# EAGLE design controller (EAGLE 6.5.0)
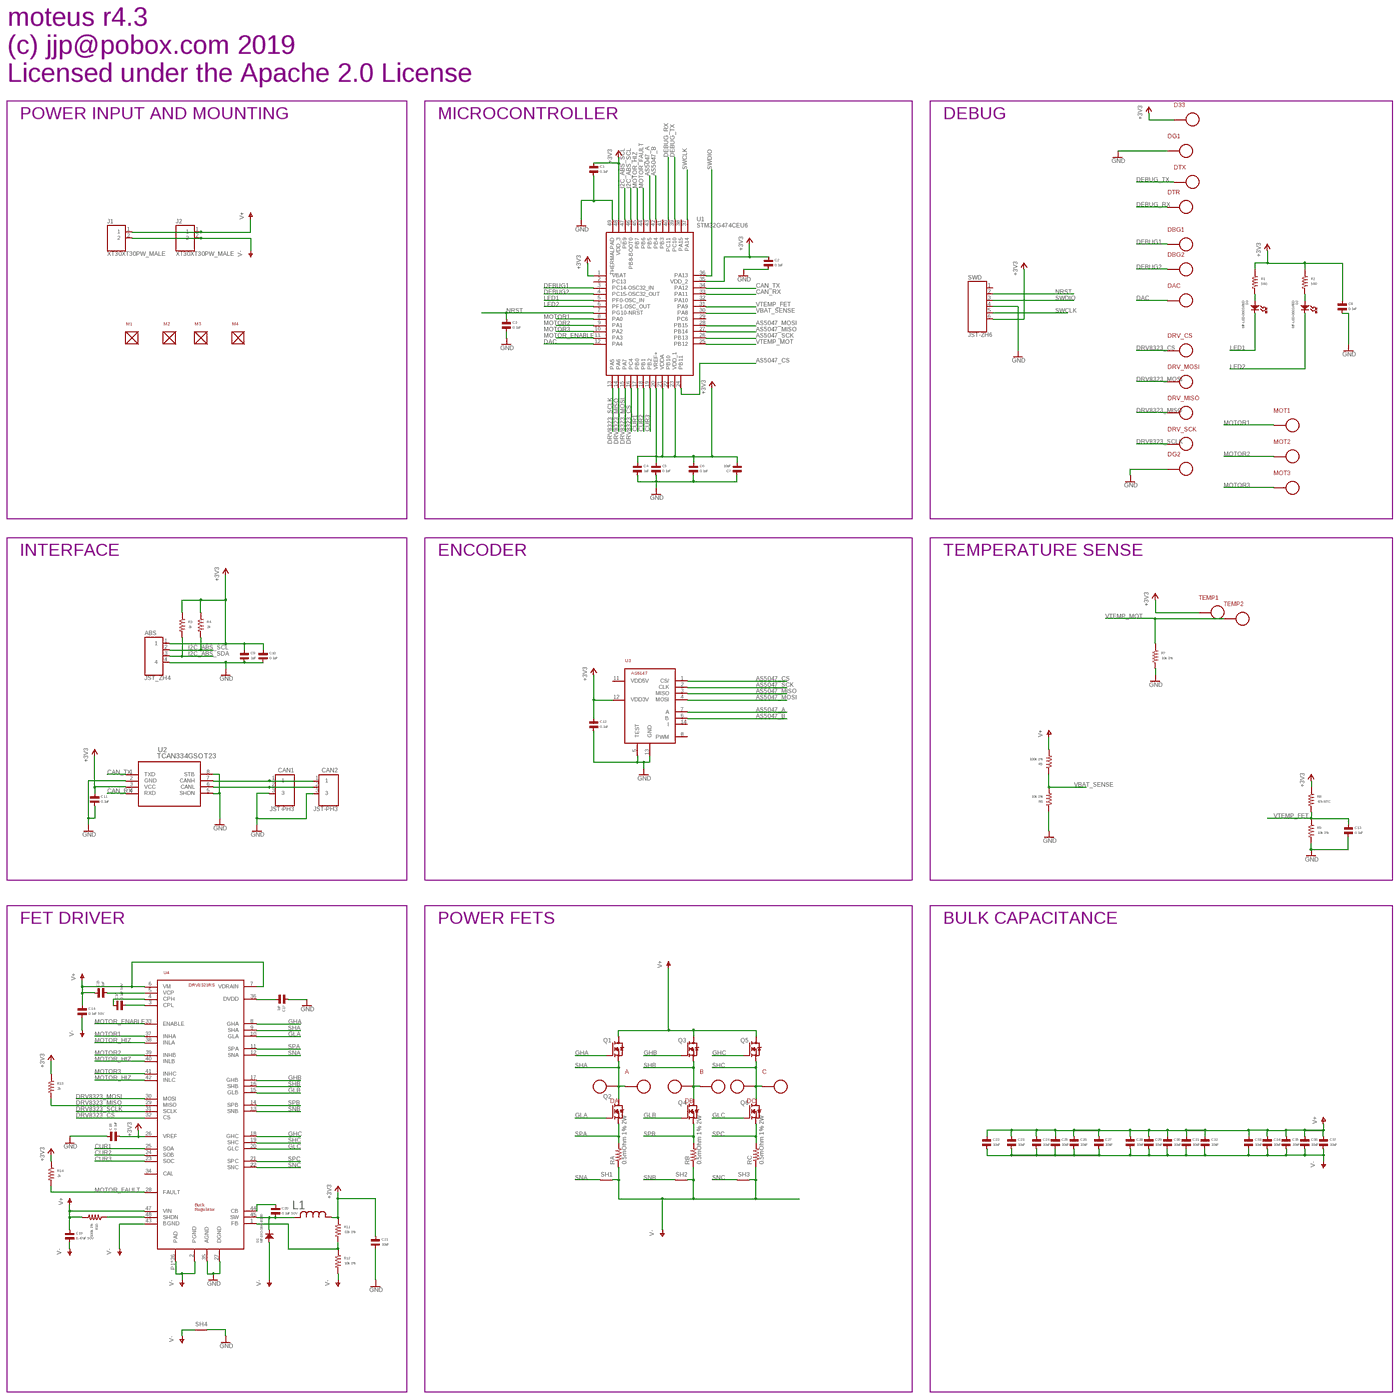
[diagram p0: schematic, sheet 1, overview]
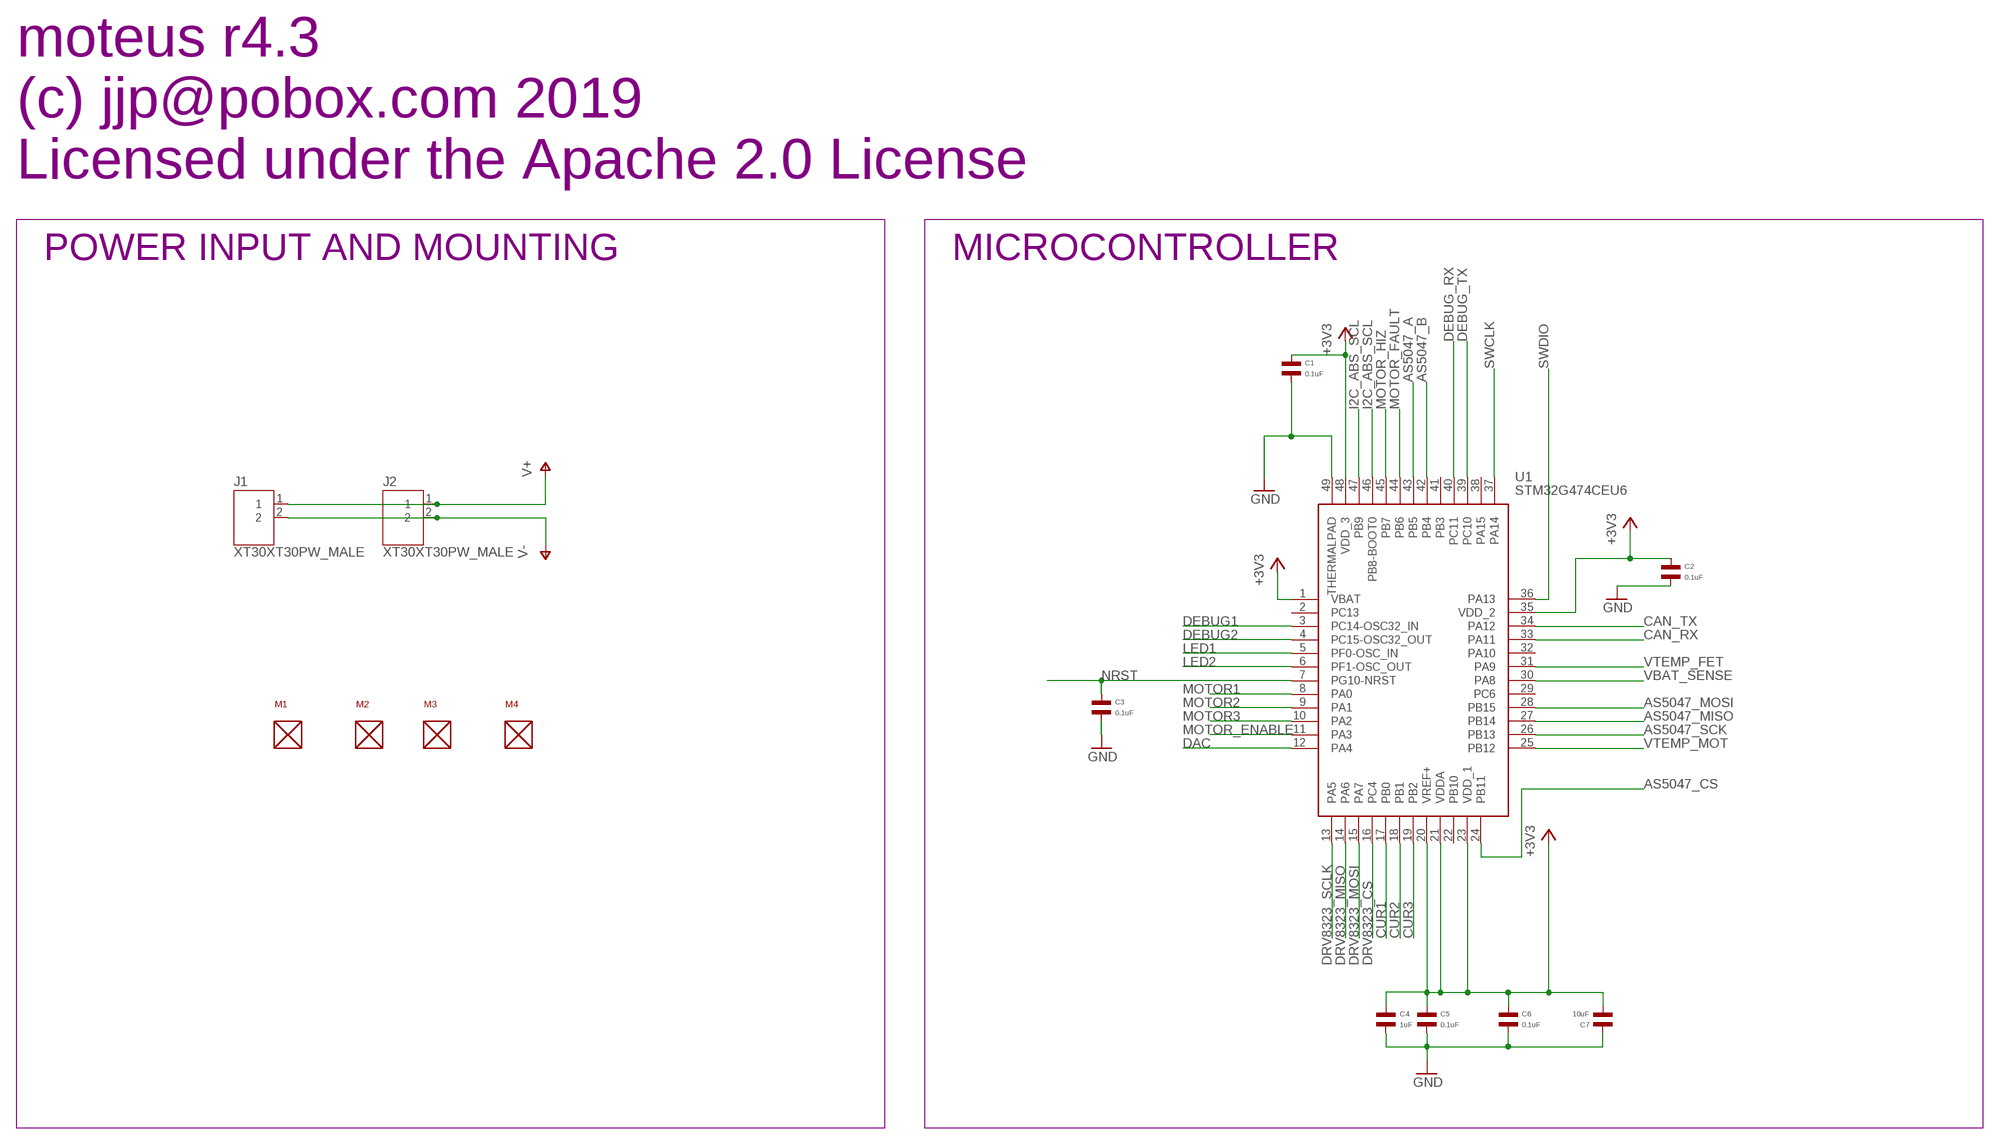
[diagram p1: schematic, sheet 1, part 1 of 4]
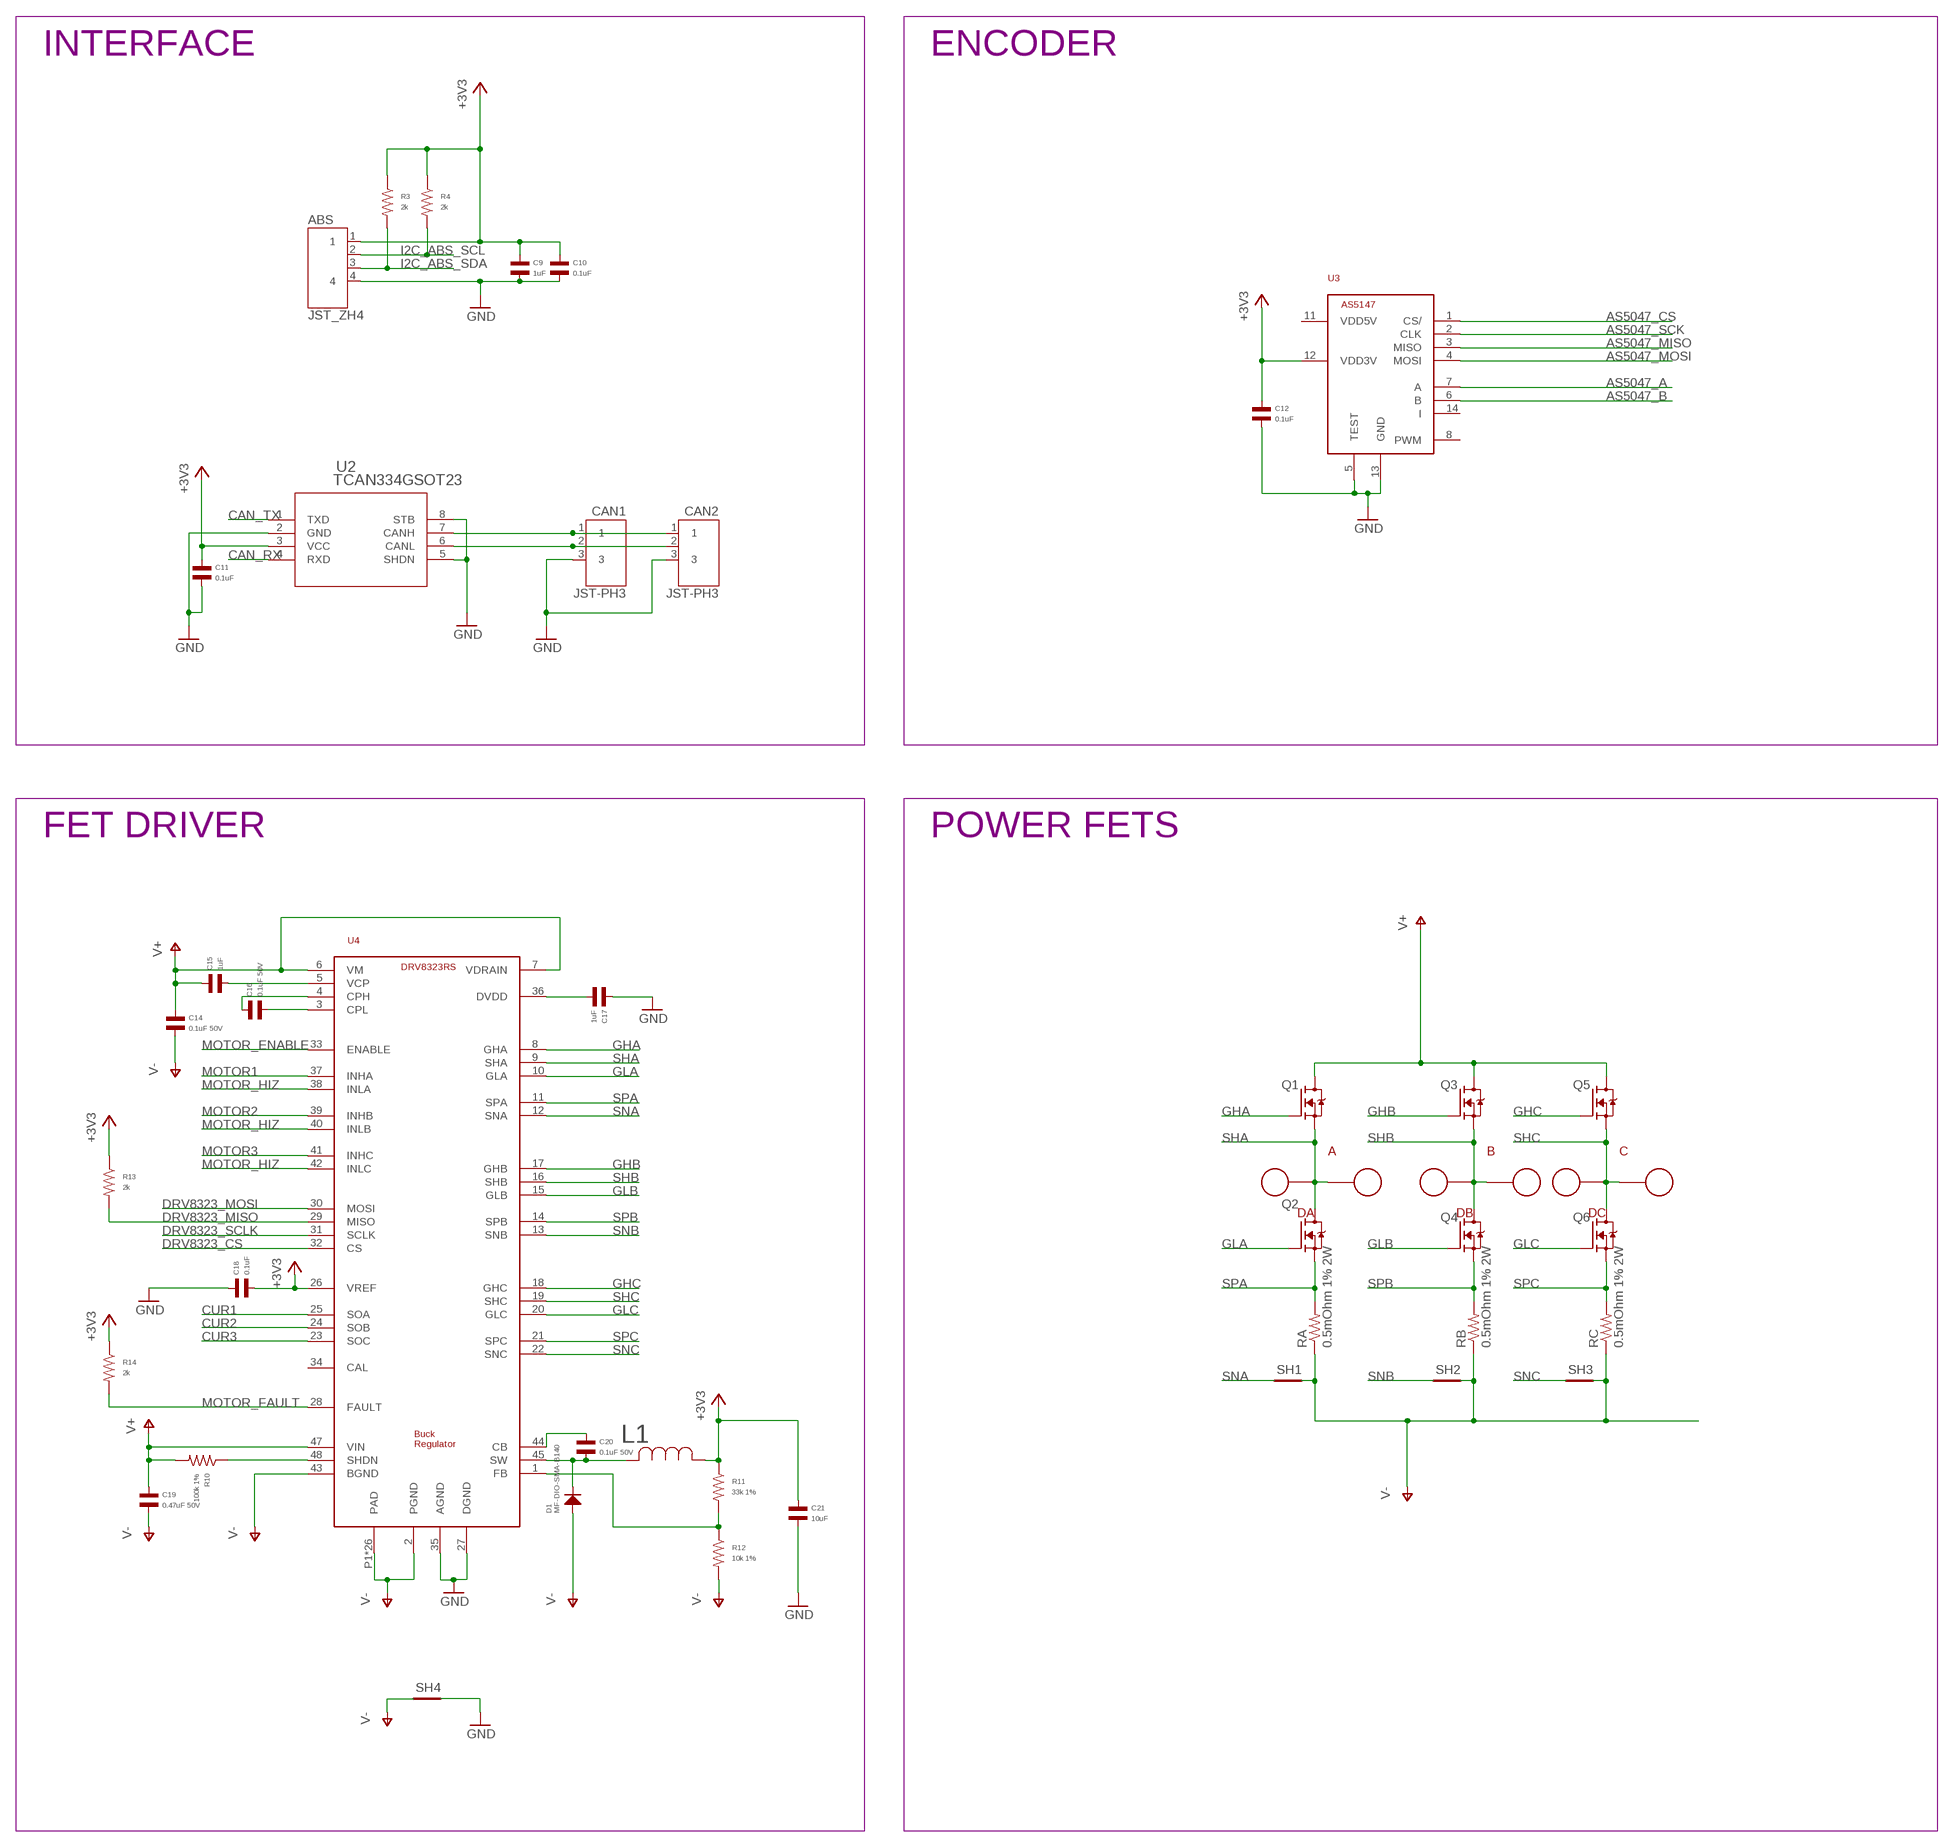
[diagram p2: schematic, sheet 1, part 2 of 4]
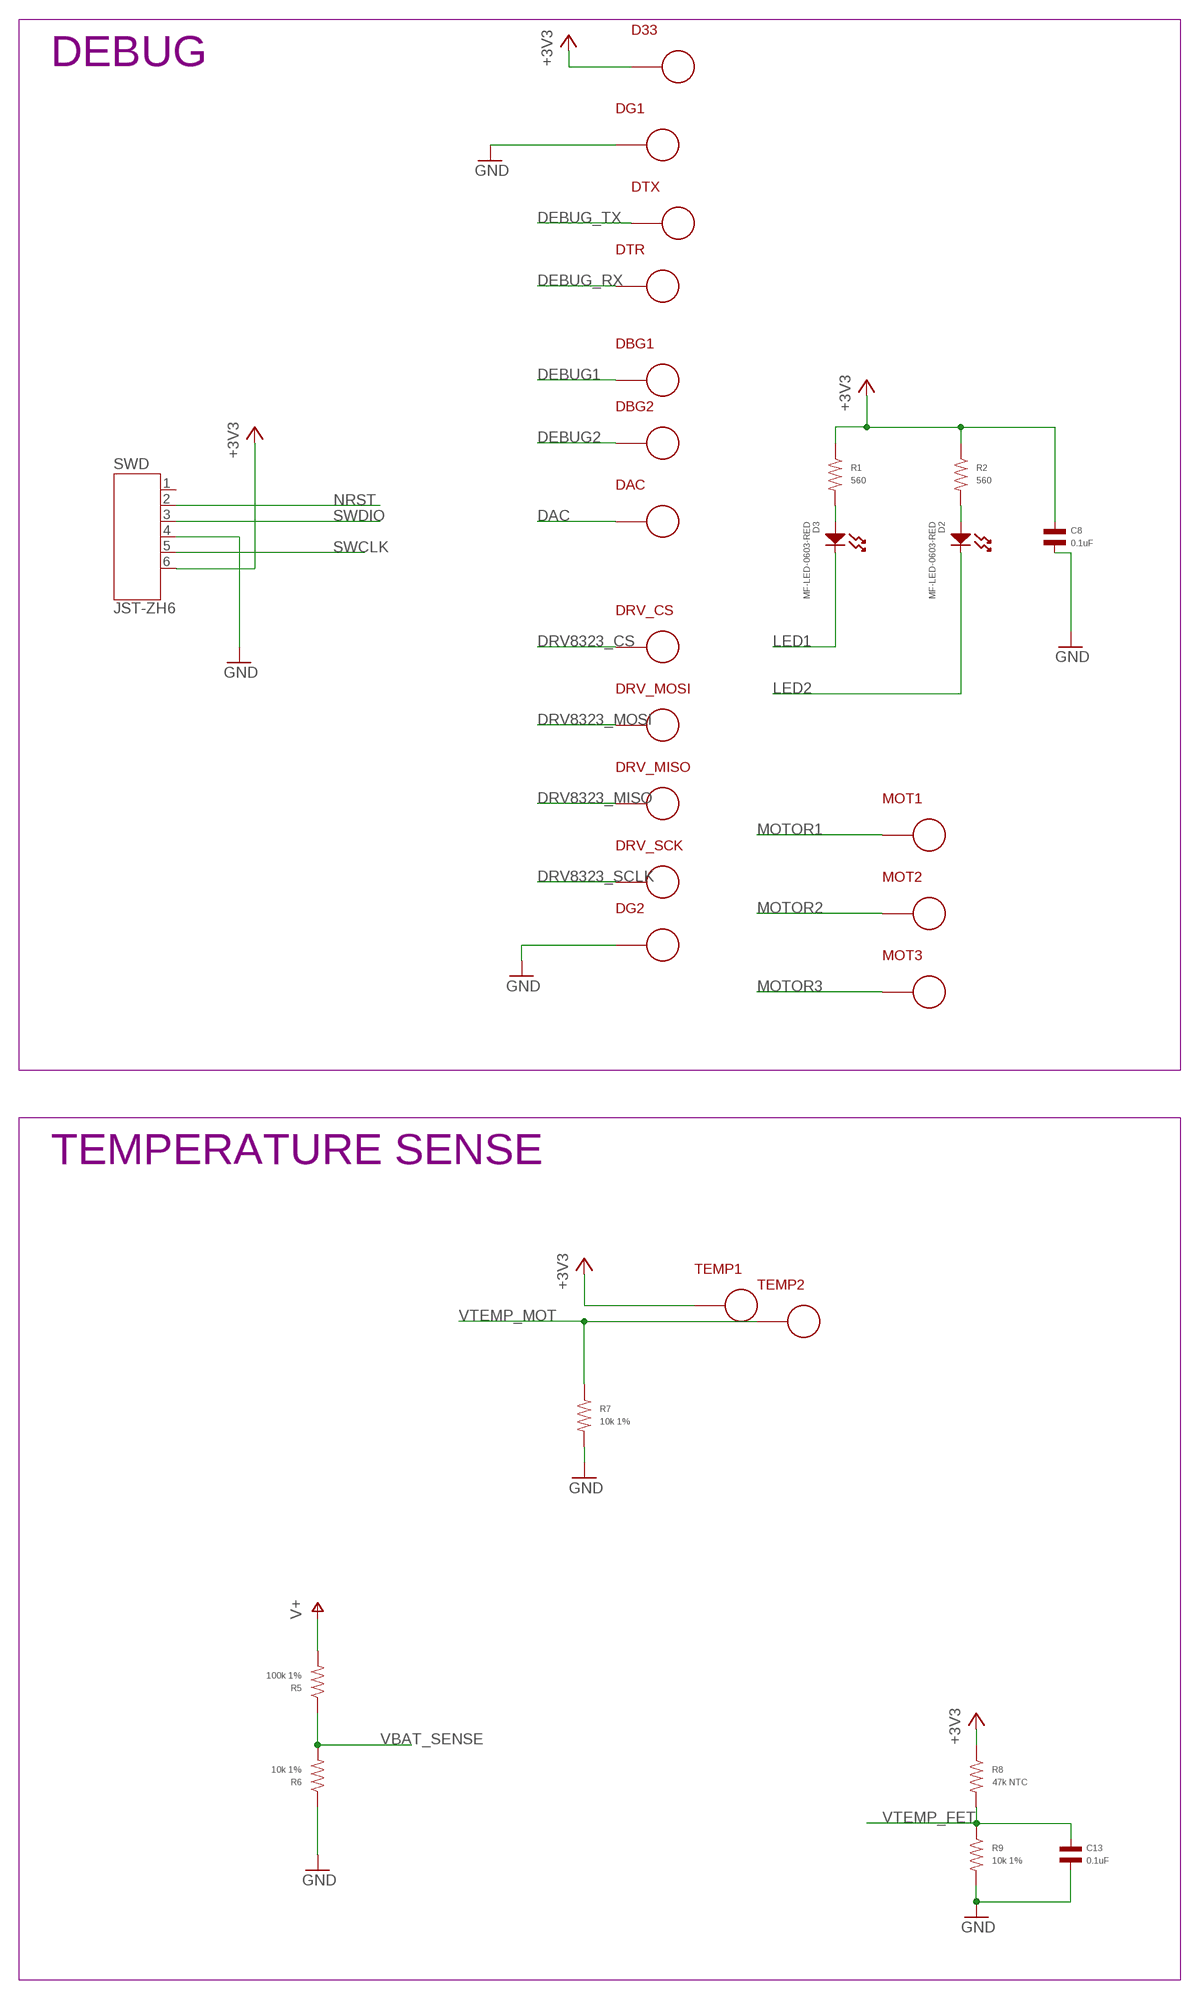
[diagram p3: schematic, sheet 1, part 3 of 4]
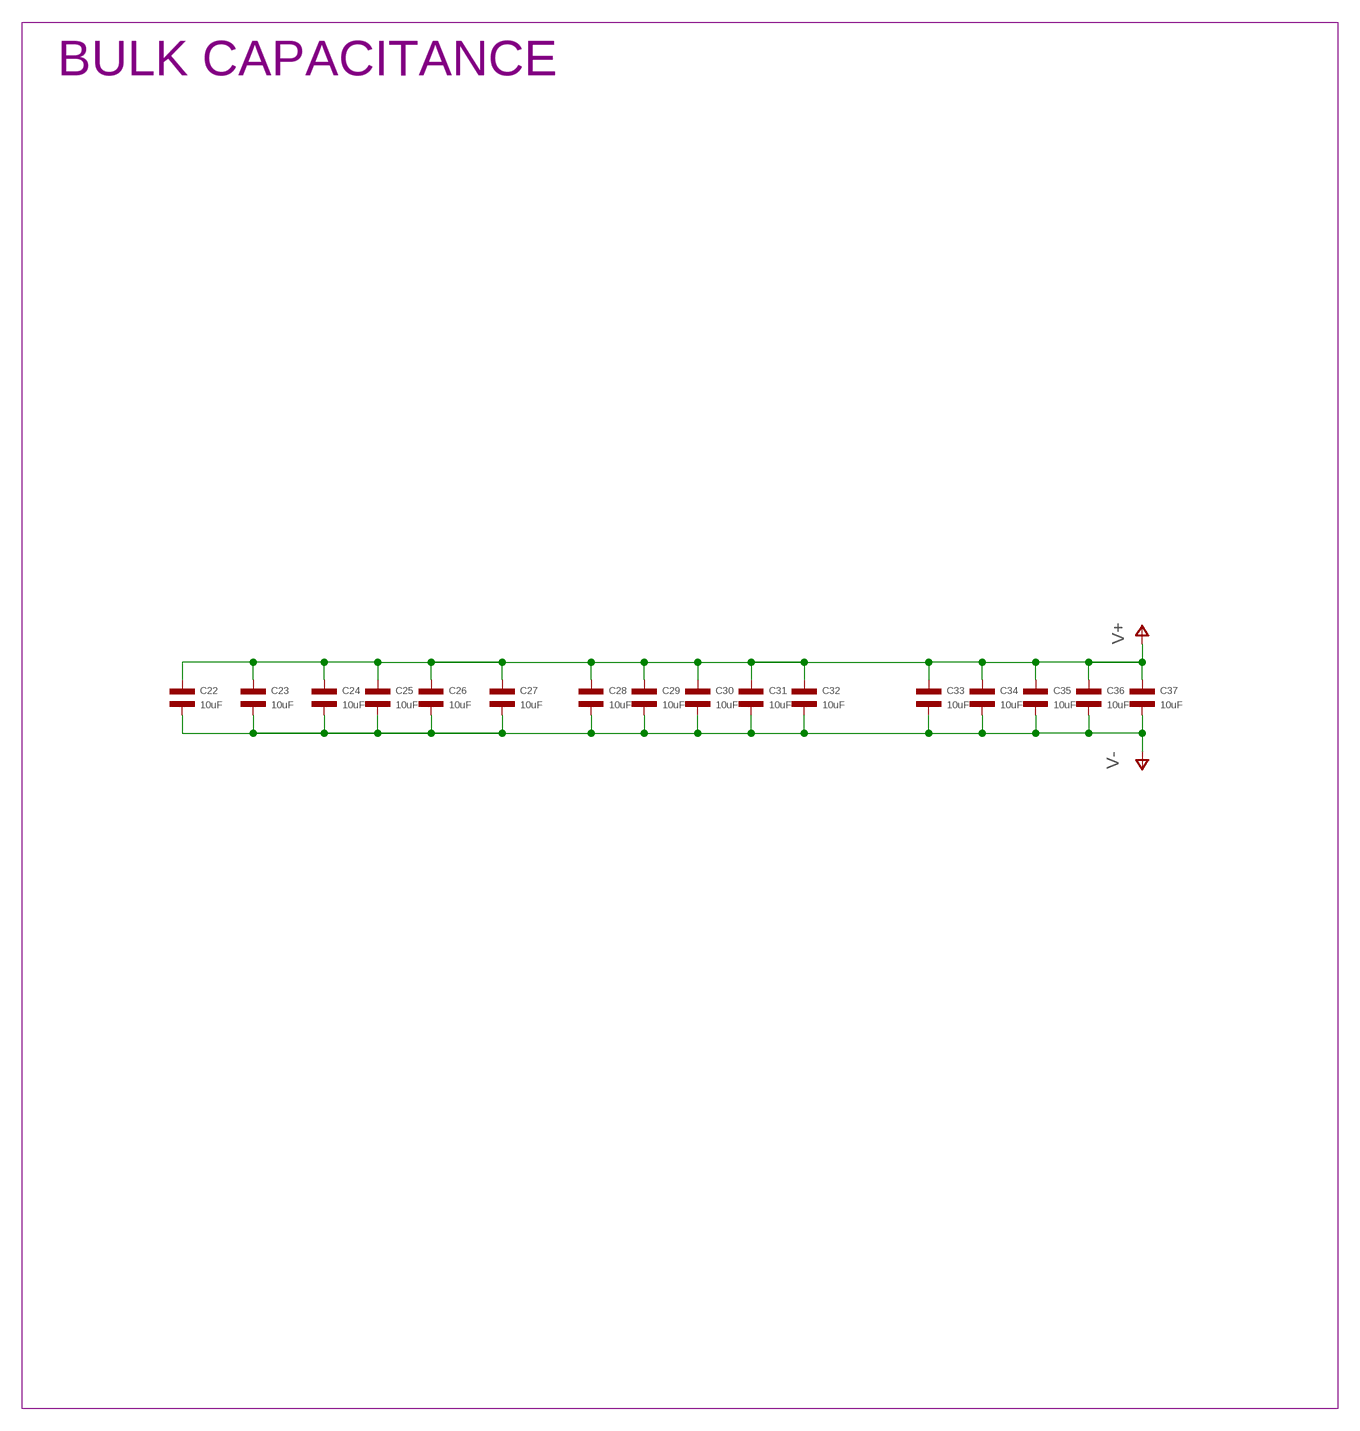
[diagram p4: schematic, sheet 1, part 4 of 4]

## Parts
A  PAD  [18AWG_PAD]
ABS  JST_ZH4  [JST_S4B-ZR-SM4A-TF(LF)(SN)]
B  PAD  [18AWG_PAD]
C  PAD  [18AWG_PAD]
C1  0.1uF  CAPACITOR_NP_0402  [C0402]
C2  0.1uF  CAPACITOR_NP_0402  [C0402]
C3  0.1uF  CAPACITOR_NP_0402  [C0402]
C4  1uF  CAPACITOR_NP_0402  [C0402]
C5  0.1uF  CAPACITOR_NP_0402  [C0402]
C6  0.1uF  CAPACITOR_NP_0402  [C0402]
C7  10uF  CAPACITOR_NP_1206  [C1206]
C8  0.1uF  CAPACITOR_NP_0402  [C0402]
C9  1uF  CAPACITOR_NP_0402  [C0402]
C10  0.1uF  CAPACITOR_NP_0402  [C0402]
C11  0.1uF  CAPACITOR_NP_0402  [C0402]
C12  0.1uF  CAPACITOR_NP_0402  [C0402]
C13  0.1uF  CAPACITOR_NP_0402  [C0402]
C14  0.1uF 50V  CAPACITOR_NP_0402  [C0402]
C15  1uF  CAPACITOR_NP_0402  [C0402]
C16  0.1uF 50V  CAPACITOR_NP_0402  [C0402]
C17  1uF  CAPACITOR_NP_0402  [C0402]
C18  0.1uF  CAPACITOR_NP_0402  [C0402]
C19  0.47uF 50V  CAPACITOR_NP_0402  [C0402]
C20  0.1uF 50V  CAPACITOR_NP_0402  [C0402]
C21  10uF  CAPACITOR_NP_1206  [C1206]
C22  10uF  CAPACITOR_NP_1206  [C1206]
C23  10uF  CAPACITOR_NP_1206  [C1206]
C24  10uF  CAPACITOR_NP_1206  [C1206]
C25  10uF  CAPACITOR_NP_1206  [C1206]
C26  10uF  CAPACITOR_NP_1206  [C1206]
C27  10uF  CAPACITOR_NP_1206  [C1206]
C28  10uF  CAPACITOR_NP_1206  [C1206]
C29  10uF  CAPACITOR_NP_1206  [C1206]
C30  10uF  CAPACITOR_NP_1206  [C1206]
C31  10uF  CAPACITOR_NP_1206  [C1206]
C32  10uF  CAPACITOR_NP_1206  [C1206]
C33  10uF  CAPACITOR_NP_1206  [C1206]
C34  10uF  CAPACITOR_NP_1206  [C1206]
C35  10uF  CAPACITOR_NP_1206  [C1206]
C36  10uF  CAPACITOR_NP_1206  [C1206]
C37  10uF  CAPACITOR_NP_1206  [C1206]
CAN1  JST-PH3  [JST_S3B-PH-SM4-TB(LF)(SN)]
CAN2  JST-PH3  [JST_S3B-PH-SM4-TB(LF)(SN)]
D1  MF-DIO-SMA-B140  DIODES_B140_SMA  [SMA]
D2  MF-LED-0603-RED  LED_SINGLE-0603-RED  [LED0603]
D3  MF-LED-0603-RED  LED_SINGLE-0603-RED  [LED0603]
D33  PAD24AWG_PAD  [24AWG_PAD]
DA  PAD24AWG_PAD  [24AWG_PAD]
DAC  PAD24AWG_PAD  [24AWG_PAD]
DB  PAD24AWG_PAD  [24AWG_PAD]
DBG1  PAD24AWG_PAD  [24AWG_PAD]
DBG2  PAD24AWG_PAD  [24AWG_PAD]
DC  PAD24AWG_PAD  [24AWG_PAD]
DG1  PAD24AWG_PAD  [24AWG_PAD]
DG2  PAD24AWG_PAD  [24AWG_PAD]
DRV_CS  PAD24AWG_PAD  [24AWG_PAD]
DRV_MISO  PAD24AWG_PAD  [24AWG_PAD]
DRV_MOSI  PAD24AWG_PAD  [24AWG_PAD]
DRV_SCK  PAD24AWG_PAD  [24AWG_PAD]
DTR  PAD24AWG_PAD  [24AWG_PAD]
DTX  PAD24AWG_PAD  [24AWG_PAD]
J1  XT30XT30PW_MALE  [XT30PW_MALE]
J2  XT30XT30PW_MALE  [XT30PW_MALE]
L1  SRN4018-220M  [IND_BOURNS_SRN4018]
M1  MOUNT  [M2.5MOUNT]
M2  MOUNT  [M2.5MOUNT]
M3  MOUNT  [M2.5MOUNT]
M4  MOUNT  [M2.5MOUNT]
MOT1  PAD24AWG_PAD  [24AWG_PAD]
MOT2  PAD24AWG_PAD  [24AWG_PAD]
MOT3  PAD24AWG_PAD  [24AWG_PAD]
Q1  TPH1R204PLSOP_ADVANCE_8  [SOP_ADVANCE_8]
Q2  TPH1R204PLSOP_ADVANCE_8  [SOP_ADVANCE_8]
Q3  TPH1R204PLSOP_ADVANCE_8  [SOP_ADVANCE_8]
Q4  TPH1R204PLSOP_ADVANCE_8  [SOP_ADVANCE_8]
Q5  TPH1R204PLSOP_ADVANCE_8  [SOP_ADVANCE_8]
Q6  TPH1R204PLSOP_ADVANCE_8  [SOP_ADVANCE_8]
R1  560  RESISTOR_0402  [R0402]
R2  560  RESISTOR_0402  [R0402]
R3  2k  RESISTOR_0402  [R0402]
R4  2k  RESISTOR_0402  [R0402]
R5  100k 1%  RESISTOR_0402  [R0402]
R6  10k 1%  RESISTOR_0402  [R0402]
R7  10k 1%  RESISTOR_0402  [R0402]
R8  47k NTC  RESISTOR_0402  [R0402]
R9  10k 1%  RESISTOR_0402  [R0402]
R10  100k 1%  RESISTOR_0402  [R0402]
R11  33k 1%  RESISTOR_0402  [R0402]
R12  10k 1%  RESISTOR_0402  [R0402]
R13  2k  RESISTOR_0402  [R0402]
R14  2k  RESISTOR_0402  [R0402]
RA  0.5mOhm 1% 2W  R-US_M1206  [M1206]
RB  0.5mOhm 1% 2W  R-US_M1206  [M1206]
RC  0.5mOhm 1% 2W  R-US_M1206  [M1206]
SH1  SHORTT5  [SHORT_TOP-50]
SH2  SHORTT5  [SHORT_TOP-50]
SH3  SHORTT5  [SHORT_TOP-50]
SH4  SHORTBIG  [SHORT_TOP-BIG]
SWD  JST-ZH6  [JST_S6B-ZR-SM4A-TF(LF)(SN)]
TEMP1  PAD24AWG_PAD  [24AWG_PAD]
TEMP2  PAD24AWG_PAD  [24AWG_PAD]
U1  STM32G474CEU6  [QFN50P700X700X60-49N]
U2  TCAN334GSOT23  [SOT23-8]
U3  AS5147  [TSSOP14]
U4  DRV8323RS  [PVQFN-N48]

## Nets
+3V3: ABS.1 C1.P$1 C2.P$1 C4.P$1 C5.P$1 C6.P$1 C7.P$2 C8.P$1 C9.P$1 C10.P$1 C11.P$1 C12.P$1 C18.P$2 C21.P$1 D33.P$1 L1.1 R1.P$1 R2.P$1 R3.P$1 R4.P$1 R8.P$1 R11.P$1 R13.P$1 R14.P$1 SWD.6 TEMP1.P$1 U1.1(VBAT) U1.20(VREF+) U1.21(VDDA) U1.23(VDD_1) U1.35(VDD_2) U1.48(VDD_3) U2.3(VCC) U3.12(VDD3V) U4.26(VREF)
AS5047_A: U1.43(PB5) U3.7(A)
AS5047_B: U1.42(PB4) U3.6(B)
AS5047_CS: U1.24(PB11) U3.1(CS/)
AS5047_MISO: U1.27(PB14) U3.3(MISO)
AS5047_MOSI: U1.28(PB15) U3.4(MOSI)
AS5047_SCK: U1.26(PB13) U3.2(CLK)
CAN_N [CAN]: CAN1.2 CAN2.2 U2.6(CANL)
CAN_P [CAN]: CAN1.1 CAN2.1 U2.7(CANH)
CAN_RX: U1.33(PA11) U2.4(RXD)
CAN_TX: U1.34(PA12) U2.1(TXD)
CUR1: U1.17(PB0) U4.25(SOA)
CUR2: U1.18(PB1) U4.24(SOB)
CUR3: U1.19(PB2) U4.23(SOC)
DAC: DAC.P$1 U1.12(PA4)
DEBUG1: DBG1.P$1 U1.3(PC14-OSC32_IN)
DEBUG2: DBG2.P$1 U1.4(PC15-OSC32_OUT)
DEBUG_RX: DTR.P$1 U1.40(PC11)
DEBUG_TX: DTX.P$1 U1.39(PC10)
DRV8323_CS: DRV_CS.P$1 U1.16(PC4) U4.32(CS)
DRV8323_MISO: DRV_MISO.P$1 R13.P$2 U1.14(PA6) U4.29(MISO)
DRV8323_MOSI: DRV_MOSI.P$1 U1.15(PA7) U4.30(MOSI)
DRV8323_SCLK: DRV_SCK.P$1 U1.13(PA5) U4.31(SCLK)
GHA: Q1.4(G) U4.8(GHA)
GHB: Q3.4(G) U4.17(GHB)
GHC: Q5.4(G) U4.18(GHC)
GLA: Q2.4(G) U4.10(GLA)
GLB: Q4.4(G) U4.15(GLB)
GLC: Q6.4(G) U4.20(GLC)
GND: ABS.4 C1.P$2 C2.P$2 C3.P$2 C4.P$2 C5.P$2 C6.P$2 C7.P$1 C8.P$2 C9.P$2 C10.P$2 C11.P$2 C12.P$2 C13.P$2 C17.P$1 C18.P$1 C21.P$2 CAN1.3 CAN2.3 DG1.P$1 DG2.P$1 R6.P$1 R7.P$2 R9.P$2 SH4.2 SWD.4 U1.49(THERMALPAD) U2.2(GND) U2.5(SHDN) U2.8(STB) U3.5(TEST) U3.13(GND) U4.27(DGND) U4.35(AGND)
I2C_ABS_SCL: ABS.2 R4.P$2 U1.46(PB8-BOOT0) U1.47(PB9)
I2C_ABS_SDA: ABS.3 R3.P$2
LED1: D3.CATHODE U1.5(PF0-OSC_IN)
LED2: D2.CATHODE U1.6(PF1-OSC_OUT)
MOTOR1: MOT1.P$1 U1.8(PA0) U4.37(INHA)
MOTOR2: MOT2.P$1 U1.9(PA1) U4.39(INHB)
MOTOR3: MOT3.P$1 U1.10(PA2) U4.41(INHC)
MOTOR_ENABLE: U1.11(PA3) U4.33(ENABLE)
MOTOR_FAULT: R14.P$2 U1.44(PB6) U4.28(FAULT)
MOTOR_HIZ: U1.45(PB7) U4.38(INLA) U4.40(INLB) U4.42(INLC)
N$5: R10.P$1 U4.48(SHDN)
N$8: R11.P$2 R12.P$1 U4.1(FB)
N$10: C16.P$2 U4.3(CPL)
N$11: C20.P$2 D1.CATHODE L1.2 U4.45(SW)
N$12: C20.P$1 U4.44(CB)
N$13: C16.P$1 U4.4(CPH)
N$14: C15.P$2 U4.5(VCP)
N$16: C17.P$2 U4.36(DVDD)
N$17: D3.ANODE R1.P$2
N$18: D2.ANODE R2.P$2
NRST: C3.P$1 SWD.2 U1.7(PG10-NRST)
SHA: A.1 DA.P$1 Q1.1(S) Q1.2(S) Q1.3(S) Q2.5(D) Q2.6(D) Q2.7(D) Q2.8(D) Q2.PAD(D) U4.9(SHA)
SHB: B.1 DB.P$1 Q3.1(S) Q3.2(S) Q3.3(S) Q4.5(D) Q4.6(D) Q4.7(D) Q4.8(D) Q4.PAD(D) U4.16(SHB)
SHC: C.1 DC.P$1 Q5.1(S) Q5.2(S) Q5.3(S) Q6.5(D) Q6.6(D) Q6.7(D) Q6.8(D) Q6.PAD(D) U4.19(SHC)
SNA: SH1.1 U4.12(SNA)
SNB: SH2.1 U4.13(SNB)
SNC: SH3.1 U4.22(SNC)
SPA: Q2.1(S) Q2.2(S) Q2.3(S) RA.2 U4.11(SPA)
SPB: Q4.1(S) Q4.2(S) Q4.3(S) RB.2 U4.14(SPB)
SPC: Q6.1(S) Q6.2(S) Q6.3(S) RC.2 U4.21(SPC)
SWCLK: SWD.5 U1.37(PA14)
SWDIO: SWD.3 U1.36(PA13)
V+: C14.P$1 C15.P$1 C19.P$1 C22.P$1 C23.P$1 C24.P$1 C25.P$1 C26.P$1 C27.P$1 C28.P$1 C29.P$1 C30.P$1 C31.P$1 C32.P$1 C33.P$1 C34.P$1 C35.P$1 C36.P$1 C37.P$1 J1.1 J2.1 Q1.5(D) Q1.6(D) Q1.7(D) Q1.8(D) Q1.PAD(D) Q3.5(D) Q3.6(D) Q3.7(D) Q3.8(D) Q3.PAD(D) Q5.5(D) Q5.6(D) Q5.7(D) Q5.8(D) Q5.PAD(D) R5.P$2 R10.P$2 U4.6(VM) U4.7(VDRAIN) U4.47(VIN)
V-: C14.P$2 C19.P$2 C22.P$2 C23.P$2 C24.P$2 C25.P$2 C26.P$2 C27.P$2 C28.P$2 C29.P$2 C30.P$2 C31.P$2 C32.P$2 C33.P$2 C34.P$2 C35.P$2 C36.P$2 C37.P$2 D1.ANODE J1.2 J2.2 R12.P$2 RA.1 RB.1 RC.1 SH1.2 SH2.2 SH3.2 SH4.1 U4.2(PGND) U4.43(BGND) U4.P1(PAD) U4.P2(PAD) U4.P3(PAD) U4.P4(PAD) U4.P5(PAD) U4.P6(PAD) U4.P7(PAD) U4.P8(PAD) U4.P9(PAD) U4.P10(PAD) U4.P11(PAD) U4.P12(PAD) U4.P13(PAD) U4.P14(PAD) U4.P15(PAD) U4.P16(PAD) U4.P17(PAD) U4.P18(PAD) U4.P19(PAD) U4.P20(PAD) U4.P21(PAD) U4.P22(PAD) U4.P23(PAD) U4.P24(PAD) U4.P25(PAD) U4.PAD
VBAT_SENSE: R5.P$1 R6.P$2 U1.30(PA8)
VTEMP_FET: C13.P$1 R8.P$2 R9.P$1 U1.31(PA9)
VTEMP_MOT: R7.P$1 TEMP2.P$1 U1.25(PB12)
Unconnected: SWD.1 U1.2(PC13) U1.22(PB10) U1.29(PC6) U1.32(PA10) U1.38(PA15) U1.41(PB3) U3.8(PWM) U3.11(VDD5V) U3.14(I) U4.34(CAL)

## Notes on the sheet
- moteus r4.3
  (c) jjp@pobox.com 2019
  Licensed under the Apache 2.0 License
- POWER INPUT AND MOUNTING | MICROCONTROLLER | DEBUG
- INTERFACE | ENCODER | TEMPERATURE SENSE
- FET DRIVER | POWER FETS | BULK CAPACITANCE

## Library data of the parts
A B C D33 DA DAC DB DBG1 DBG2 DC DG1 DG2 DRV_CS DRV_MISO DRV_MOSI DRV_SCK DTR DTX MOT1-MOT3 TEMP1 TEMP2 = controller:PAD; POPULATE: 0
ABS = controller:JST_ZH4; MF: JST; MPN: S4B-ZR-SM4A-TF(LF)(SN); POPULATE: 1
C1-C3 C5 C6 C8 C10-C13 C18 = mfpassives:CAPACITOR_NP: Library: MF_Passives Description: Device for Non-Polarized Capacitors. Manufacture part number (MPN) can be added via Attributes. Check https://factory.macrofab.com/parts for the house parts list.; HOUSEPART: YES; MPN: MF-CAP-0402-0.1uF; POPULATE: 1
C4 C9 C15 C17 = mfpassives:CAPACITOR_NP: Library: MF_Passives Description: Device for Non-Polarized Capacitors. Manufacture part number (MPN) can be added via Attributes. Check https://factory.macrofab.com/parts for the house parts list.; HOUSEPART: YES; MPN: MF-CAP-0402-1uF; POPULATE: 1
C7 C21 = mfpassives:CAPACITOR_NP: Library: MF_Passives Description: Device for Non-Polarized Capacitors. Manufacture part number (MPN) can be added via Attributes. Check https://factory.macrofab.com/parts for the house parts list.; HOUSEPART: YES; MPN: MF-CAP-1206-10uF; POPULATE: 1
C14 C16 C20 = mfpassives:CAPACITOR_NP: Library: MF_Passives Description: Device for Non-Polarized Capacitors. Manufacture part number (MPN) can be added via Attributes. Check https://factory.macrofab.com/parts for the house parts list.; MF: TDK; MPN: CGA2B3X7R1H104K050BB; POPULATE: 1
C19 = mfpassives:CAPACITOR_NP: Library: MF_Passives Description: Device for Non-Polarized Capacitors. Manufacture part number (MPN) can be added via Attributes. Check https://factory.macrofab.com/parts for the house parts list.; MF: Taiyo Yuden; MPN: UMK105ABJ474KV-F; POPULATE: 1
C22-C37 = mfpassives:CAPACITOR_NP: Library: MF_Passives Description: Device for Non-Polarized Capacitors. Manufacture part number (MPN) can be added via Attributes. Check https://factory.macrofab.com/parts for the house parts list.; MF: TDK; MPN: CGA5L1X7R1H106K160AC; POPULATE: 1
CAN1 CAN2 = controller:JST-PH3; MF: JST; MPN: S3B-PH-SM4-TB(LF)(SN); POPULATE: 1
D1 = mfdiscretesemi:DIODES: Library: MF_Discrete_Semiconductor Description: Device for Single Packaged Diodes.; HOUSEPART: YES; MPN: MF-DIO-SMA-B140; POPULATE: 1; URL: https://factory.macrofab.com/part/MF-DIO-SMA-B140
D2 = mfleds:LED_SINGLE: Library: MF_LEDs Description: Device for Single LED Packages. Manufacture part number (MFG#) can be added via Attributes.; HOUSEPART: YES; MPN: MF-LED-0603-GREEN; POPULATE: 1; URL: https://factory.macrofab.com/part/MF-LED-0603-RED
D3 = mfleds:LED_SINGLE: Library: MF_LEDs Description: Device for Single LED Packages. Manufacture part number (MFG#) can be added via Attributes.; HOUSEPART: YES; MPN: MF-LED-0603-RED; POPULATE: 1; URL: https://factory.macrofab.com/part/MF-LED-0603-RED
J1 J2 = controller:XT30; POPULATE: 0
L1 = controller:SRN4018-220M; MANUFACTURER_PART_NUMBER: SRN4018220M; MPN: SRN4018-220M; POPULATE: 1; VENDOR: Bourns Electronics
M1-M4 = controller:MOUNT; POPULATE: 0
Q1-Q6 = controller:TPH1R204PL; MF: Toshiba; MPN: TPH1R204PL,L1Q; POPULATE: 1
R1 R2 = mfpassives:RESISTOR: Library: MF_Passives Description: Device for Resistors. Manufacture part number (MPN), Voltage, Tolerance, and Wattage Rating can be added via Attributes. Check https://factory.macrofab.com/parts for the house parts list.; HOUSEPART: 1; MPN: MF-RES-0402-560; POPULATE: 1
R3 R4 R13 R14 = mfpassives:RESISTOR: Library: MF_Passives Description: Device for Resistors. Manufacture part number (MPN), Voltage, Tolerance, and Wattage Rating can be added via Attributes. Check https://factory.macrofab.com/parts for the house parts list.; HOUSEPART: YES; MPN: MF-RES-0402-2K; POPULATE: 1
R5 R10 = mfpassives:RESISTOR: Library: MF_Passives Description: Device for Resistors. Manufacture part number (MPN), Voltage, Tolerance, and Wattage Rating can be added via Attributes. Check https://factory.macrofab.com/parts for the house parts list.; MF: Panasonic; MPN: ERJ-2RKF1003X; POPULATE: 1
R6 R7 R9 R12 = mfpassives:RESISTOR: Library: MF_Passives Description: Device for Resistors. Manufacture part number (MPN), Voltage, Tolerance, and Wattage Rating can be added via Attributes. Check https://factory.macrofab.com/parts for the house parts list.; MF: Panasonic; MPN: ERJ-2RKF1002X; POPULATE: 1
R8 = mfpassives:RESISTOR: Library: MF_Passives Description: Device for Resistors. Manufacture part number (MPN), Voltage, Tolerance, and Wattage Rating can be added via Attributes. Check https://factory.macrofab.com/parts for the house parts list.; MF: Murata; MPN: NCP15WB473F03RC; POPULATE: 1
R11 = mfpassives:RESISTOR: Library: MF_Passives Description: Device for Resistors. Manufacture part number (MPN), Voltage, Tolerance, and Wattage Rating can be added via Attributes. Check https://factory.macrofab.com/parts for the house parts list.; MF: Panasonic; MPN: ERJ-2RKF3302X; POPULATE: 1
RA RB RC = rcl:R-US_: RESISTOR, American symbol; MF: Stackpole Electronics; MPN: HCS1206FTL500; POPULATE: 1
SH1-SH3 = shorts:SHORT: Short between two nets; BOM: no; POPULATE: 0
SH4 = shorts:SHORT: Short between two nets; POPULATE: 0
SWD = controller:JST-ZH6; MF: JST; MPN: S6B-ZR-SM4A-TF(LF)(SN); POPULATE: 1
U1 = controller:STM32G474CEU6: STMICROELECTRONICS - STM32G474CEU6 - MCU, 32BIT, 170MHZ, UFQFPN-48 Source: Datasheet <https://componentsearchengine.com/Datasheets/1/STM32G474CEU6.pdf>; DESCRIPTION: STMICROELECTRONICS - STM32G474CEU6 - MCU, 32BIT, 170MHZ, UFQFPN-48; HEIGHT: 0.6mm; MANUFACTURER_NAME: STMicroelectronics; MANUFACTURER_PART_NUMBER: STM32G474CEU6; MOUSER_PART_NUMBER: 511-STM32G474CEU6; MOUSER_PRICE-STOCK: https://www.mouser.com/Search/Refine.aspx?Keyword=511-STM32G474CEU6; MPN: STM32G474CEU6; POPULATE: 1
U2 = controller:TCAN334G; MF: TI; MPN: TCAN334GDCNT; POPULATE: 1
U3 = controller:AS5147; MF: AMS; MPN: AS5047P-ATSM; POPULATE: 1
U4 = controller:DRV8323RS; MF: TI; MPN: DRV8323RSRGZR; POPULATE: 1

## Net classes
0 default: width 0.127 mm
1 CAN: width 0.216 mm, clearance 0.127 mm

## Board
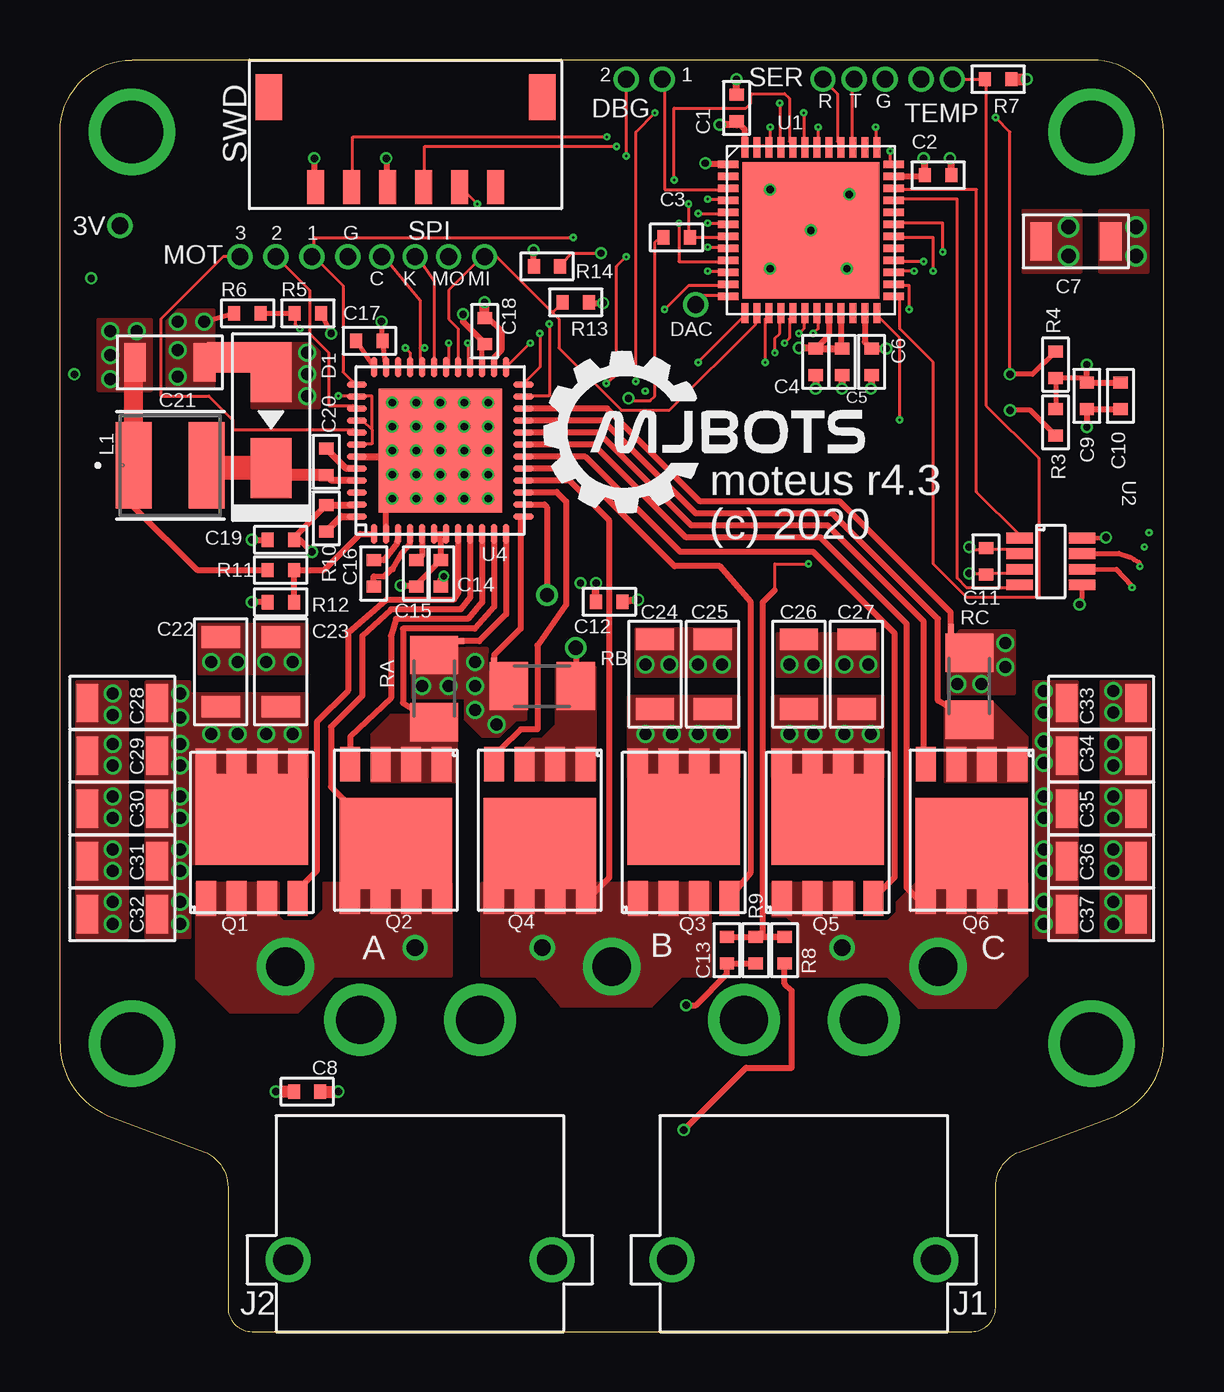
[diagram p5: board, top side]
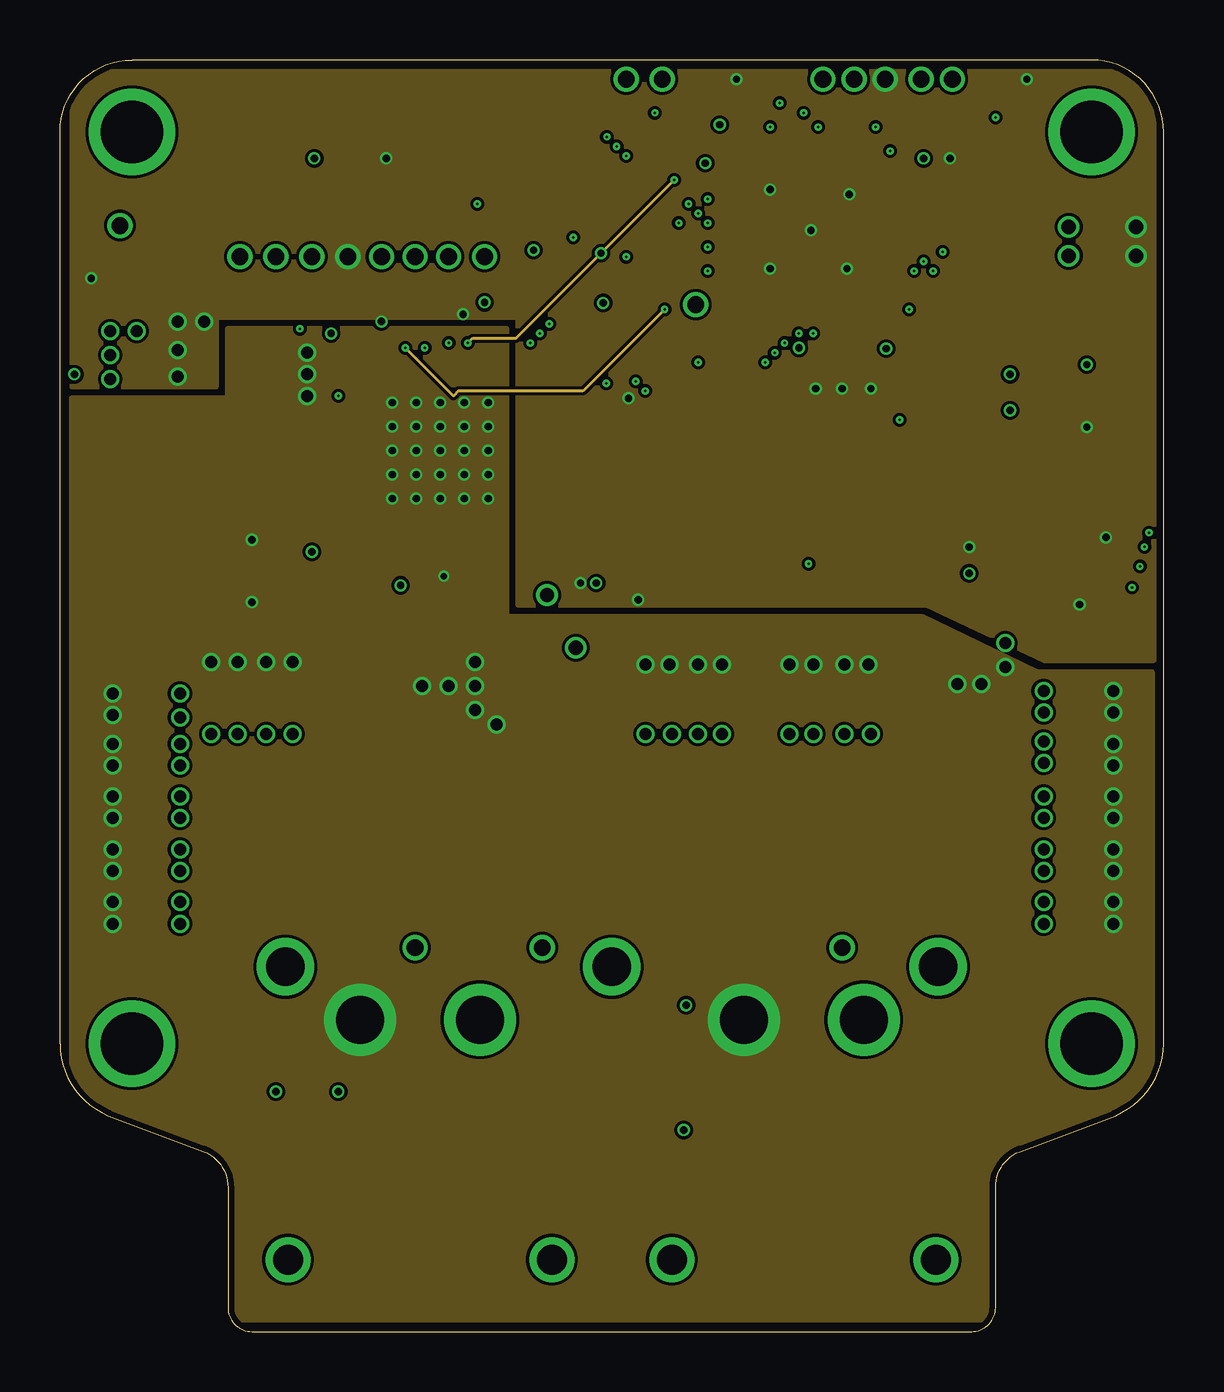
[diagram p6: board, inner layer Route2]
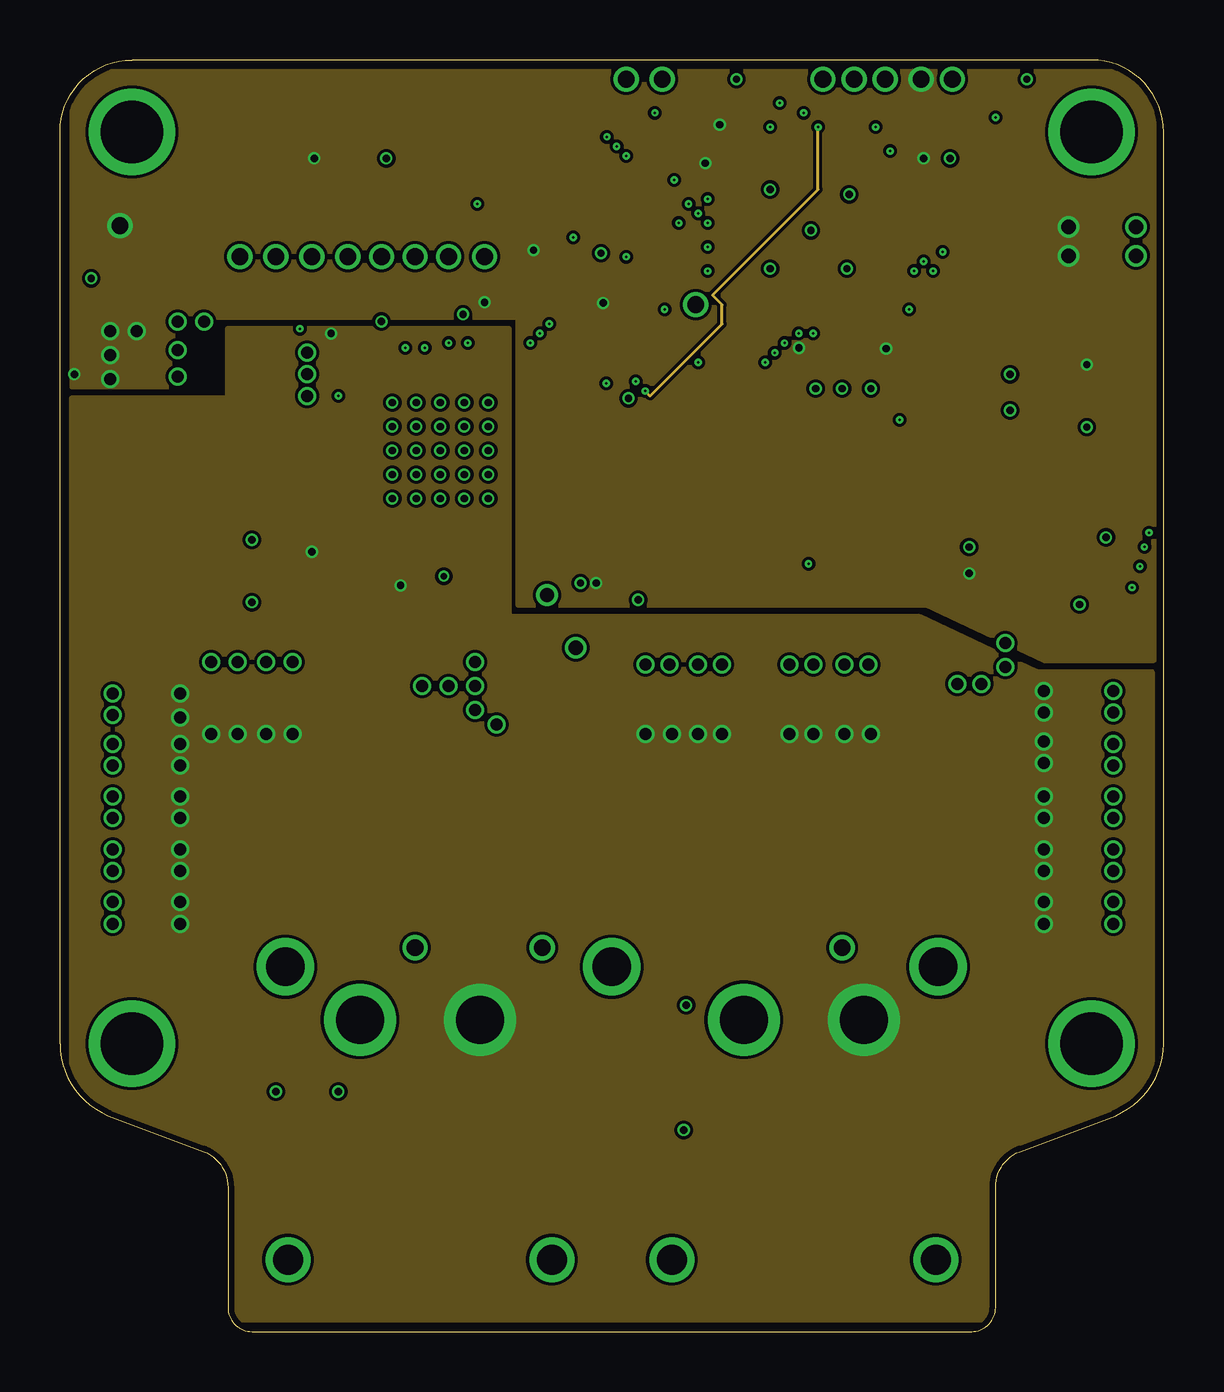
[diagram p7: board, inner layer Route15]
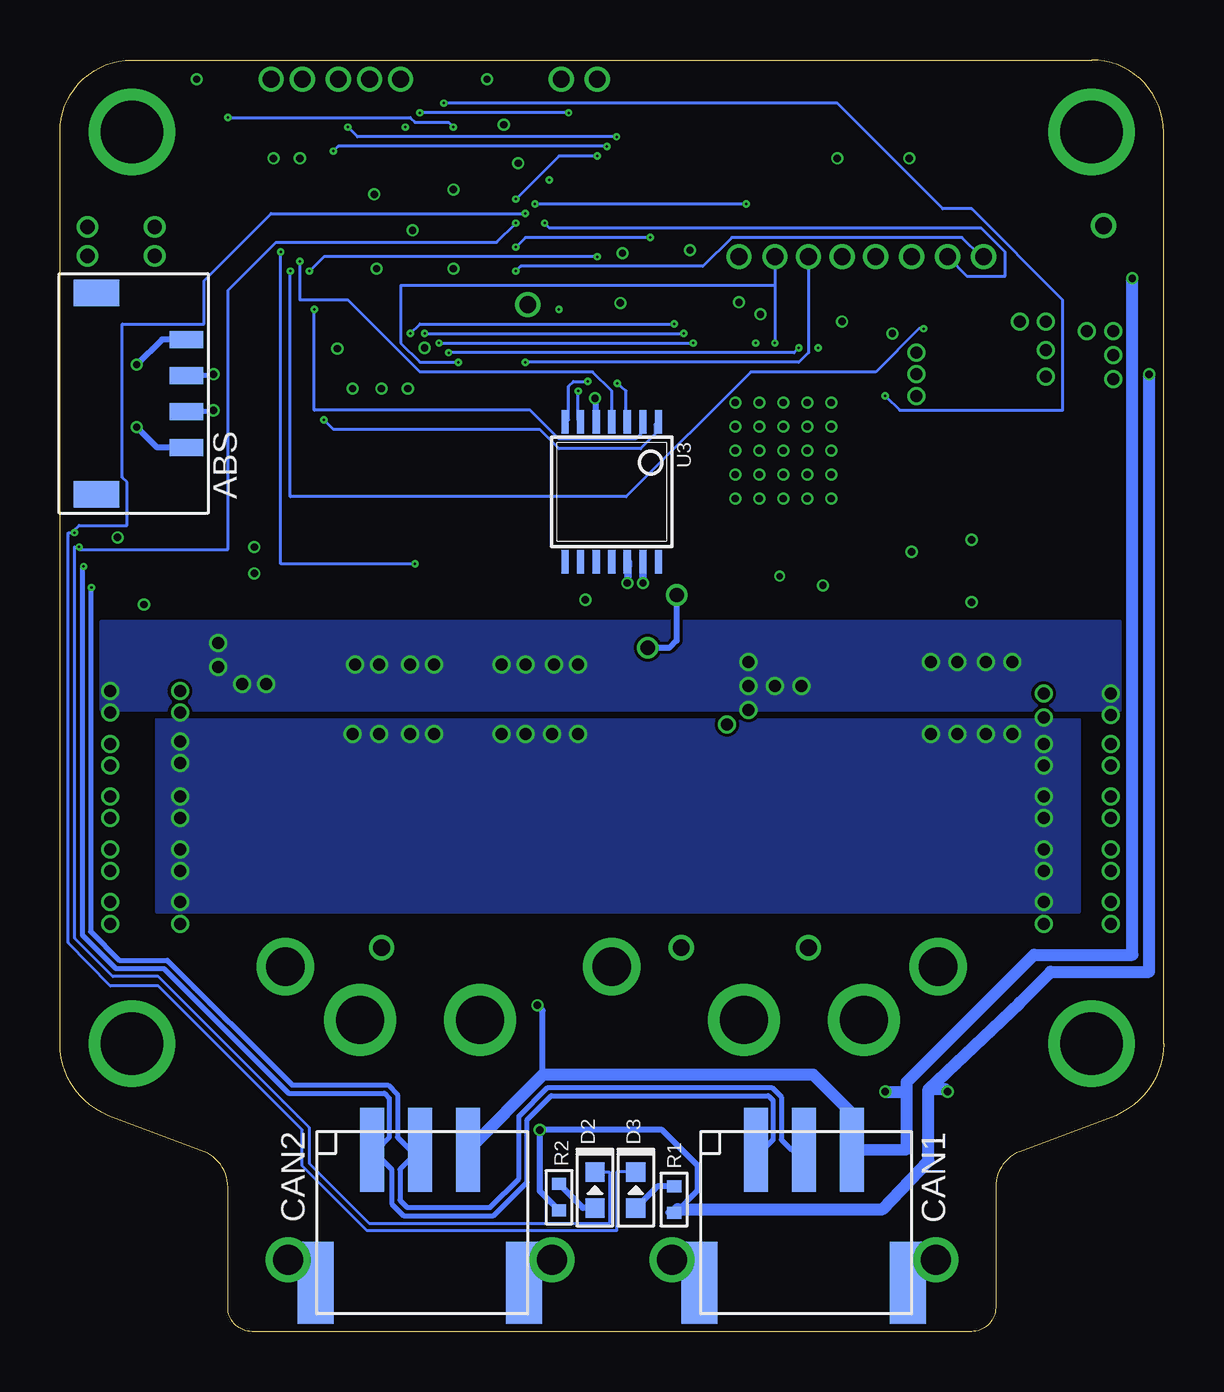
[diagram p8: board, bottom side, seen from below]

Size 46 x 53 mm. Coordinates in mm from the lower left corner, seen from the top.
Outline: 0,12 0,50 arc-90 3,53 43,53 arc-90 46,50 46,12 arc-67 44,9 40,7.5 arc68 39,6 39,1 arc-90 38,0 8,0 arc-90 7,1 7,6 arc68 6,7.5 2,9 arc-67 0,12
Copper layers (1*2*15*16): Top 0.035mm / dielectric 0.23mm / Route2 0.035mm / dielectric 0.93mm / Route15 0.035mm / dielectric 0.23mm / Bottom 0.035mm
Design rules "MF_4_mil_drill_4_Layer": minimum track width 5mil, minimum drill 4mil, track to track 5mil, track to pad 5mil, pad to pad 5mil, via to via 5mil, smd to smd 0mil, copper to edge 10mil, drill to drill 10mil, minimum pad ring 4mil, minimum via ring 4mil, stop-mask expansion 2mil, vias tented up to drill 25mil, thermal gap 10mil

### Footprints (pad centres in the part's own frame; a part is rotated, then mirrored left to right if it is on the bottom)
18AWG_PAD = drill 1.6: 1 0,0
JST_S4B-ZR-SM4A-TF(LF)(SN) = smd 0.7 x 1.4: 1 2.25,-1.27; 2 0.75,-1.27; 3 -0.75,-1.27; 4 -2.25,-1.27 | smd 1.1 x 1.9: P1 4.2,2.48; P2 -4.2,2.48
C0402 = smd 0.5 x 0.6: P$1 -0.55,0; P$2 0.55,0
C1206 = smd 0.9 x 1.6: P$1 -1.45,0; P$2 1.45,0
JST_S3B-PH-SM4-TB(LF)(SN) = smd 1 x 3.5: 1 2,-2.98; 2 0,-2.98; 3 -2,-2.98 | smd 1.5 x 3.4: S1 -4.35,2.57; S2 4.35,2.57
SMA = smd 2.5 x 1.7: ANODE 2,0; CATHODE -2,0
LED0603 = smd 0.8 x 0.8: ANODE 0.75,0; CATHODE -0.75,0
24AWG_PAD = drill 0.7: P$1 0,0
XT30PW_MALE = drill 2: 1 -2.5,0; 2 2.5,0 | drill 1.25: M1 -5.5,10; M2 5.5,10
IND_BOURNS_SRN4018 = smd 1.499 x 3.607: 1 -1.524,0; 2 1.524,0
M2.5MOUNT = drill 2.6: P$1 0,0
SOP_ADVANCE_8 = smd 0.85 x 1.45: 1 -1.905,-2.95; 2 -0.635,-2.95; 3 0.635,-2.95; 4 1.905,-2.95 | smd 0.85 x 1.1: 5 1.925,2.75; 6 0.637,2.75; 7 -0.637,2.75; 8 -1.925,2.75 | smd 4.7 x 3.8: PAD 0,0.35
R0402 = smd 0.5 x 0.6: P$1 -0.55,0; P$2 0.55,0
M1206 = smd 1.6 x 2: 1 -1.4,0; 2 1.4,0
SHORT_TOP-50 = smd 0.254 x 0.254: 1 0.127,0; 2 -0.127,0
SHORT_TOP-BIG = smd 1.27 x 1.27: 1 0.635,0; 2 -0.635,0
JST_S6B-ZR-SM4A-TF(LF)(SN) = smd 0.7 x 1.4: 1 3.75,0; 2 2.25,0; 3 0.75,0; 4 -0.75,0; 5 -2.25,0; 6 -3.75,0 | smd 1.1 x 1.9: P1 5.7,3.75; P2 -5.7,3.75
QFN50P700X700X60-49N = smd 0.85 x 0.3: 1 -3.45,2.75; 2 -3.45,2.25; 3 -3.45,1.75; 4 -3.45,1.25; 5 -3.45,0.75; 6 -3.45,0.25; 7 -3.45,-0.25; 8 -3.45,-0.75; 9 -3.45,-1.25; 10 -3.45,-1.75; 11 -3.45,-2.25; 12 -3.45,-2.75; 25 3.45,-2.75; 26 3.45,-2.25; 27 3.45,-1.75; 28 3.45,-1.25; 29 3.45,-0.75; 30 3.45,-0.25; 31 3.45,0.25; 32 3.45,0.75; 33 3.45,1.25; 34 3.45,1.75; 35 3.45,2.25; 36 3.45,2.75 | smd 0.3 x 0.85: 13 -2.75,-3.45; 14 -2.25,-3.45; 15 -1.75,-3.45; 16 -1.25,-3.45; 17 -0.75,-3.45; 18 -0.25,-3.45; 19 0.25,-3.45; 20 0.75,-3.45; 21 1.25,-3.45; 22 1.75,-3.45; 23 2.25,-3.45; 24 2.75,-3.45; 37 2.75,3.45; 38 2.25,3.45; 39 1.75,3.45; 40 1.25,3.45; 41 0.75,3.45; 42 0.25,3.45; 43 -0.25,3.45; 44 -0.75,3.45; 45 -1.25,3.45; 46 -1.75,3.45; 47 -2.25,3.45; 48 -2.75,3.45 | smd 5.7 x 5.7: 49 0,0
SOT23-8 = smd 0.45 x 1.1: 1 -0.975,-1.3; 2 -0.325,-1.3; 3 0.325,-1.3; 4 0.975,-1.3; 5 0.975,1.3; 6 0.325,1.3; 7 -0.325,1.3; 8 -0.975,1.3
TSSOP14 = smd 0.305 x 0.991: 1 -1.95,-2.918; 2 -1.3,-2.918; 3 -0.65,-2.918; 4 0,-2.918; 5 0.65,-2.918; 6 1.3,-2.918; 7 1.95,-2.918; 8 1.95,2.918; 9 1.3,2.918; 10 0.65,2.918; 11 0,2.918; 12 -0.65,2.918; 13 -1.3,2.918; 14 -1.95,2.918
PVQFN-N48 = smd 0.28 x 0.85: 1 2.75,3.475; 2 2.25,3.475; 3 1.75,3.475; 4 1.25,3.475; 5 0.75,3.475; 6 0.25,3.475; 7 -0.25,3.475; 8 -0.75,3.475; 9 -1.25,3.475; 10 -1.75,3.475; 11 -2.25,3.475; 12 -2.75,3.475; 25 -2.75,-3.475; 26 -2.25,-3.475; 27 -1.75,-3.475; 28 -1.25,-3.475; 29 -0.75,-3.475; 30 -0.25,-3.475; 31 0.25,-3.475; 32 0.75,-3.475; 33 1.25,-3.475; 34 1.75,-3.475; 35 2.25,-3.475; 36 2.75,-3.475 | smd 0.85 x 0.28: 13 -3.475,2.75; 14 -3.475,2.25; 15 -3.475,1.75; 16 -3.475,1.25; 17 -3.475,0.75; 18 -3.475,0.25; 19 -3.475,-0.25; 20 -3.475,-0.75; 21 -3.475,-1.25; 22 -3.475,-1.75; 23 -3.475,-2.25; 24 -3.475,-2.75; 37 3.475,-2.75; 38 3.475,-2.25; 39 3.475,-1.75; 40 3.475,-1.25; 41 3.475,-0.75; 42 3.475,-0.25; 43 3.475,0.25; 44 3.475,0.75; 45 3.475,1.25; 46 3.475,1.75; 47 3.475,2.25; 48 3.475,2.75 | drill 0.305: P1 -2,2; P2 -1,2; P3 0,2; P4 1,2; P5 2,2; P6 -2,1; P7 -1,1; P8 0,1; P9 1,1; P10 2,1; P11 -2,0; P12 -1,0; P13 0,0; P14 1,0; P15 2,0; P16 -2,-1; P17 -1,-1; P18 0,-1; P19 1,-1; P20 2,-1; P21 -2,-2; P22 -1,-2; P23 0,-2; P24 1,-2; P25 2,-2 | smd 5.15 x 5.15: PAD 0,0

### Placement (x,y rotation side)
A  9.4,15.2 0 top
ABS  42,39.1 90 bottom
B  23,15.2 0 top
C  36.6,15.2 0 top
C1  28.2,51 90 top
C2  36.6,48.2 0 top
C3  25.7,45.6 180 top
C4  31.5,40.42 270 top
C5  32.6,40.42 270 top
C6  33.83,40.42 270 top
C7  42.35,45.44 180 top
C8  10.3,10 0 top
C9  42.8,39 270 top
C10  44.2,39 270 top
C11  38.6,32.1 90 top
C12  22.9,30.42 0 top
C13  27.8,15.9 270 top
C14  15.87,31.6 270 top
C15  14.86,31.6 90 top
C16  13.08,31.6 90 top
C17  12.9,41.3 180 top
C18  17.7,41.7 90 top
C19  9.2,33 180 top
C20  11.1,36.25 270 top
C21  4.58,40.4 0 top
C22  6.7,27.5 90 top
C23  9.2,27.5 90 top
C24  24.8,27.4 90 top
C25  27.2,27.4 90 top
C26  30.8,27.4 90 top
C27  33.2,27.4 90 top
C28  2.6,26.2 180 top
C29  2.6,24 180 top
C30  2.6,21.8 180 top
C31  2.6,19.6 180 top
C32  2.6,17.4 180 top
C33  43.4,26.2 0 top
C34  43.4,24 0 top
C35  43.4,21.8 0 top
C36  43.4,19.6 0 top
C37  43.4,17.4 0 top
CAN1  15,4.6 180 bottom
CAN2  31,4.6 180 bottom
D1  8.8,38 90 top
D2  23.7,5.9 270 bottom
D3  22,5.9 270 bottom
D33  2.5,46.1 0 top
DA  14.8,16 0 top
DAC  26.5,42.8 270 top
DB  20.1,16 0 top
DBG1  25.1,52.2 270 top
DBG2  23.6,52.2 270 top
DC  32.6,16 0 top
DG1  12,44.8 0 top
DG2  34.4,52.2 0 top
DRV_CS  13.4,44.8 0 top
DRV_MISO  17.7,44.8 0 top
DRV_MOSI  16.2,44.8 0 top
DRV_SCK  14.8,44.8 0 top
DTR  31.8,52.2 270 top
DTX  33.1,52.2 270 top
J1  31,13 180 top
J2  15,13 180 top
L1  4.6,36.1 0 top
M1  3,50 0 top
M2  43,50 0 top
M3  3,12 0 top
M4  43,12 0 top
MOT1  10.5,44.8 0 top
MOT2  9,44.8 0 top
MOT3  7.5,44.8 0 top
Q1  8,21 0 top
Q2  14,20.7 180 top
Q3  26,21 0 top
Q4  20,20.7 180 top
Q5  32,21 0 top
Q6  38,20.7 180 top
R1  20.4,5.5 90 bottom
R2  25.2,5.6 90 bottom
R3  41.5,37.9 270 top
R4  41.5,40.3 90 top
R5  10.33,42.44 0 top
R6  7.82,42.44 0 top
R7  39.1,52.2 0 top
R8  30.2,15.9 90 top
R9  29,15.9 270 top
R10  11.1,33.9 90 top
R11  9.2,31.74 0 top
R12  9.2,30.4 180 top
R13  21.5,42.9 180 top
R14  20.3,44.4 0 top
RA  15.6,26.8 270 top
RB  20.1,26.9 0 top
RC  37.9,26.9 270 top
SH1  16.59,28.78 0 top
SH2  18.1,27.84 90 top
SH3  37.13,29.23 90 top
SH4  7.4,40.6 0 top
SWD  14.4,47.7 0 top
TEMP1  35.9,52.2 0 top
TEMP2  37.2,52.2 0 top
U1  31.3,45.9 0 top
U2  41.3,32.1 270 top
U3  23,35 180 bottom
U4  15.85,36.72 180 top

### Tracks (layer width: path | path; a pad name or v marks a point on that pad's centre or on a via)
+3V3  (via drill 0.3, 0.5, 0.6)
  Top 0.127: v37.9,31.6 38.6,31.6 | 38.6,31.6 40,31.6 U2.3 | 38.6,31.6 C11.P$1
  Top 0.216: C9.P$1 42.6,39.75 R4.P$1 R3.P$1
  Top 0.254: L1.1 3.08,34.37 5.71,31.74 R11.P$1 | v42.8,40.3 C9.P$1 C10.P$1 | SWD.6 v10.6,48.9 | C18.P$2 17.85,42.25 18.4,41.7 18.4,40.9 18.1,40.6 U4.26 | v26,8.4 28.6,11 30.5,11 30.5,14.2 30.2,14.5 R8.P$1 | U1.23 33.55,41.25 C6.P$1 | U1.21 32.55,41.02 C5.P$1 | U1.20 32.05,41.52 C4.P$1 | U1.1 26.95,48.65 v26.9,48.7 | U1.48 28.55,50.1 C1.P$1 | U1.35 36,48.15 C2.P$1 | R14.P$1 19.74,44.51 v19.74,45.07 | R13.P$1 22.08,42.87 v22.64,42.87
  Top 0.3: C1.P$1 28.2,50.3 v27.5,50.3 | C2.P$1 36.05,48.85 v36,48.9 | C6.P$1 v34.44,40.97 | v30.8,41 31.47,41 C4.P$1 C5.P$1
  Top 0.305: C12.P$1 22.3,30.52 v22.35,31.2
  Top 0.406: C18.P$2 v17.7,42.9
  Top 0.5: C8.P$1 v9,10
  Top 0.8: L1.1 3.08,40.35 C21.P$1
  Bottom 0.254: ABS.1 41.75,41.35 v42.8,40.3 | 20.65,4.95 R1.P$1 20.35,4.95 19.4,5.9 19.4,6.9 20.9,8.4 v26,8.4 26,5.85 R2.P$1
  Bottom 0.305: U3.12 22.3,32.08 v22.35,31.2
  Bottom 0.5: R1.P$1 20.25,5.1 11.7,5.1 9.8,7.1 9.8,10.1 | 9.8,10.1 6,13.7 4.7,15 0.6,15 v0.6,39.9 | v9,10 9.1,10.1 9.8,10.1
  other vias: 2.1,39.7 2.1,40.7 2.1,41.7 3.2,41.7 42.05,44.84 42.05,46.04
  pour Route15 (no thermals): 0.5,39.4 6.5,39.4 6.5,42.3 19.1,42.3 19.1,30.3 36.1,30.3 41,28 45.6,28 45.6,52.5 0.5,52.5
  pour Top (no thermals): 1.6,42.2 3.8,42.2 3.8,39.2 1.6,39.2
  pour Top (no thermals): 42.55,44.14 40.15,44.14 40.15,46.74 42.55,46.74
AS5047_A  (via drill 0.1)
  Top 0.127: v31,50.8 31,49.4 U1.43 | v24.8,50.8 24,50 v24,39.6
  Bottom 0.127: v24.8,50.8 v31,50.8 | v24,39.6 24.6,39.6 24.8,39.4 24.8,38 U3.7
AS5047_B  (via drill 0.1)
  Top 0.127: v31.6,50.2 31.6,49.4 U1.42
  Route15 0.127: v31.6,50.2 31.6,47.6 27.2,43.2 27.6,42.8 27.6,42 24.6,39 v24.4,39.2
  Bottom 0.127: v24.4,39.2 24.4,38 U3.6
AS5047_CS  (via drill 0.1)
  Top 0.127: v35,38 35,41.4 34,42.4 U1.24
  Bottom 0.127: v35,38 34.6,37.6 26,37.6 25.2,36.8 21.8,36.8 21.2,37.4 21.2,37.8 U3.1
AS5047_MISO  (via drill 0.1)
  Top 0.127: v35.6,44.2 34.8,44.2 U1.27 | v23.6,44.8 23.2,44.4 23.2,39.86 v22.77,39.52
  Bottom 0.127: v35.6,44.2 35,44.8 v23.6,44.8 | v22.77,39.52 22.4,39.2 22.4,38 U3.3
AS5047_MOSI  (via drill 0.1)
  Top 0.127: v36,44.6 34.8,44.6 U1.28
  Bottom 0.127: v36,44.6 36,43 34,43 31,40 23.8,40 23,39.2 U3.4
AS5047_SCK  (via drill 0.1)
  Top 0.127: v35.4,42.6 35.4,43.6 34.8,43.6 U1.26
  Bottom 0.127: v35.4,42.6 35.4,38.4 26.4,38.4 25.2,37.2 22,37.2 21.8,37.4 21.8,37.8 U3.2
CAN_N  (via drill 0.1)
  Top 0.216: U2.6 44.04,31.77 44.66,31.09 44.73,31.03 v44.68,31.01
  Bottom 0.216: CAN1.2 15.51,7.58 15.93,8 15.93,9.77 16.33,10.17 25.67,10.17 26.87,8.97 26.87,6.37 28.07,5.17 31.53,5.17 31.83,5.47 31.83,6.75 CAN2.2 31.41,7.58 31.93,8.1 31.93,9.87 32.33,10.27 36.33,10.27 41.53,15.47 43.53,15.47 44.73,16.67 44.73,30.97 v44.68,31.01
CAN_P  (via drill 0.1)
  Top 0.216: U2.7 44.14,32.44 44.6,32.27 44.77,32.17 44.97,32.07 v45.01,31.89
  Bottom 0.216: CAN1.1 16.69,7.58 16.27,8 16.27,9.63 16.47,9.83 25.53,9.83 26.53,8.83 26.53,6.23 27.93,4.83 31.67,4.83 32.17,5.33 32.17,6.75 CAN2.1 32.79,7.58 32.27,8.1 32.27,9.73 32.47,9.93 36.47,9.93 41.67,15.13 43.67,15.13 45.07,16.53 45.07,31.83 v45.01,31.89
CAN_RX
  Top 0.127: U1.33 34.8,47.2 37.4,47.2 37.4,31.4 37.8,31 40,31 U2.4
CAN_TX
  Top 0.127: U1.34 34.8,47.6 38.2,47.6 38.2,35 40,33.2 U2.1
CUR1  (via drill 0.1)
  Top 0.127: v19.6,41.2 U4.25 | v30.2,41.2 30.4,41.4 30.4,42.2 30.6,42.4 U1.17
  Bottom 0.127: v30.2,41.2 v19.6,41.2
CUR2  (via drill 0.1)
  Top 0.127: v20,41.6 20,40.2 19.4,39.6 U4.24 | v30.8,41.6 31,41.8 31,42.4 U1.18
  Bottom 0.127: v30.8,41.6 v20,41.6
CUR3  (via drill 0.1)
  Top 0.127: v20.4,42 20.4,39 19.4,39 U4.23 | v31.4,41.6 31.6,41.8 31.6,42.4 U1.19
  Bottom 0.127: v20.4,42 31,42 v31.4,41.6
DAC
  Top 0.127: U1.12 27.8,43.2 26.6,43.2 26.6,42.8 DAC.P$1
DEBUG1
  Top 0.127: U1.3 27.8,47.6 25.2,47.6 25.2,52.2 DBG1.P$1
DEBUG2  (via drill 0.1)
  Top 0.127: v27,47.2 27.8,47.2 U1.4 | DBG2.P$1 v23.6,49
  Bottom 0.127: v27,47.2 25.2,49 v23.6,49
DEBUG_RX
  Top 0.127: DTR.P$1 32.4,51.6 32.4,49.6 32.6,49.4 U1.40
DEBUG_TX
  Top 0.127: U1.39 33,49.4 33,52.2 DTX.P$1
DRV8323_CS  (via drill 0.1)
  Top 0.127: 15,41 15,43 13.5,44.8 DRV_CS.P$1 | 15,41 15,40.2 U4.32 | v29.8,40.8 29.8,41.4 30,41.6 30,42.4 U1.16 | 15,41 v15.2,41
  Bottom 0.127: v29.8,40.8 15.4,40.8 v15.2,41
DRV8323_MISO
  Top 0.127: U4.29 16.6,41.8 16.2,42.2 16.2,43.4 17.6,44.8 DRV_MISO.P$1 18.2,44.8 20.55,42.45 | 20.55,42.45 20.8,42.2 20.8,41 23.4,38.4 25.4,38.4 29,42 29,42.4 U1.14 | R13.P$2 20.55,42.5 20.55,42.45
DRV8323_MOSI  (via drill 0.1)
  Top 0.127: v16.2,41.2 16.2,40.2 U4.30 | v29.4,40.4 29.4,42.2 29.6,42.4 U1.15
  Bottom 0.127: DRV_MOSI.P$1 16.2,43.6 | 16.2,43.6 v16.2,41.2 | v29.4,40.4 31,40.4 31.8,41.2 31.8,43.6 16.2,43.6
DRV8323_SCLK  (via drill 0.1)
  Top 0.127: U4.31 15.6,43.8 14.9,44.8 DRV_SCK.P$1 | v26.6,40.4 28.6,42.4 U1.13
  Bottom 0.127: v26.6,40.4 15.2,40.4 14.8,40.8 DRV_SCK.P$1
GHA
  Top 0.254: U4.8 16.6,30.8 16.4,30.5 13.6,30.5 12.01,29.12 12,26.7 10.7,25.4 10.7,19.2 9.9,18.41 Q1.4
GHB
  Top 0.254: Q3.4 28.8,19.14 28.8,30.4 27.5,31.9 25.62,31.9 21.55,35.97 U4.17
GHC
  Top 0.254: Q5.4 34.8,18.95 34.8,29.1 31.4,32.5 25.86,32.5 21.9,36.46 19.34,36.46 U4.18
GLA
  Top 0.254: U4.10 17.6,30.4 17,29.7 14,29.7 13.8,29 13.8,26.4 12.1,24.8 Q2.4
GLB
  Top 0.254: U4.15 19.36,35 20.7,35 21.1,34.6 21.1,30.3 19.9,28.6 19.9,25.1 19.2,25.1 18.39,24.3 Q4.4
GLC
  Top 0.254: Q6.4 36,23.75 36,29.6 32,33.6 26.32,33.6 22.45,37.47 U4.20
GND  (via drill 0.3, 0.5, 0.6)
  Top 0.127: 38.6,32.6 38,32.6 v37.9,32.7 | 38.6,32.6 40,32.6 U2.2 40,32.4 | 38.6,32.6 C11.P$2 | C3.P$2 25,45.6 24.8,45.4 24.8,39 24.6,38.8 23.8,38.8 v23.7,38.9
  Top 0.216: U2.5 42.6,30.59 v42.5,30.3 | U2.8 v43.6,33.1 | U4.27 17.6,41.15 C18.P$1 | U4.35 C17.P$1 v13.4,42.1 | v6,42.1 R6.P$1
  Top 0.254: C10.P$2 C9.P$2 v42.8,37.7 | v13.6,48.9 SWD.4 | v26.1,13.6 26.5,13.6 27.8,14.9 C13.P$2 R9.P$2 | v16.8,42.4 16.8,42.1 17.7,41.2 C18.P$1
  Top 0.3: C1.P$2 v28.2,52.2 | 37.25,48.2 C2.P$2 37.15,48.9 v37.1,48.9 | C4.P$2 v31.5,39.3 | C5.P$2 v32.6,39.3 | C6.P$2 33.85,39.75 v33.8,39.3 | 31.55,45.9 U1.49
  Top 0.305: C12.P$2 24.1,30.52 v24.1,30.5
  Top 0.5: C8.P$2 v11.6,10 | R7.P$2 v40.3,52.2
  Bottom 0.254: ABS.4 41.95,36.85 v42.8,37.7 | 25.88,10.7 25.88,13.38 v26.1,13.6 | U3.5 23.65,38.85 v23.7,38.9
  Bottom 0.305: U3.13 v21.7,31.2
  Bottom 0.5: 10.7,10 10.7,7.6 CAN1.3 13,9.1 14.6,10.7 25.88,10.7 CAN2.3 | 10.7,10 10.7,10.4 5.4,15.7 1.3,15.7 v1.3,43.9 | v11.6,10 10.7,10
  other vias: 4.9,39.8 4.9,40.9 4.9,42.1 44.85,44.84 44.85,46.04 31.3,45.9 32.9,47.4 29.6,47.6 29.6,44.3 32.8,44.3
  pour Route2 (no thermals): 0.5,39.4 6.5,39.4 6.5,42.3 19.1,42.3 19.1,30.3 36.1,30.3 41,28 45.6,28 45.6,52.5 0.5,52.5
  pour Top (no thermals): 4.4,39.5 4.4,42.6 6.4,42.6 6.4,39.3 4.7,39.3 4.4,39.3
  pour Top (no thermals): 45.35,44.14 43.35,44.14 43.35,46.74 45.35,46.74
I2C_ABS_SCL  (via drill 0.1, 0.3)
  Top 0.127: 41.4,41 R4.P$2 | 29.6,49.4 29,49.4 U1.47 | v29.6,50.2 29.6,49.4 | v39,50.6 39.6,50 v39.6,39.9 | 29.6,49.4 U1.46
  Top 0.216: R4.P$2 40.55,39.9 v39.6,39.9
  Bottom 0.127: v29.6,50.2 29.8,50.4 31.2,50.4 31.4,50.6 v39,50.6
  Bottom 0.216: v39.6,39.9 39.65,39.85 ABS.2
I2C_ABS_SDA  (via drill 0.31)
  Top 0.216: R3.P$2 40.45,38.4 v39.6,38.4
  Bottom 0.216: v39.6,38.4 39.65,38.35 ABS.3
LED1  (via drill 0.1)
  Top 0.127: v26.6,46.6 27.8,46.6 U1.5
  Bottom 0.127: D3.CATHODE 22.8,6.65 22.8,4.2 33.2,4.2 35.9,6.9 35.9,8.4 41.9,14.4 43.9,14.4 45.65,16.2 45.65,33.3 v45.4,33.3 45.4,33.4 45.2,33.6 43.2,33.6 43.2,35.4 43.4,35.6 43.4,42 40,42 40,43.8 37.2,46.6 v26.6,46.6
LED2  (via drill 0.1)
  Top 0.127: v27,46.2 27.8,46.2 U1.6
  Bottom 0.127: D2.CATHODE 23.1,6.65 23.1,4.5 33.1,4.5 35.6,7 35.6,8.5 41.9,14.8 43.8,14.8 45.38,16.39 45.39,32.7 v45.2,32.7 45.2,32.6 39,32.6 39,43.4 37,45.4 27.8,45.4 v27,46.2
MOTOR1  (via drill 0.1)
  Top 0.127: 10.6,44.8 11.8,43.6 11.8,40 12.2,39.6 U4.37 | v27,45.2 27.8,45.2 U1.8 | v21.4,45.6 10.6,45.6 10.6,44.8 | 10.6,44.8 MOT1.P$1
  Bottom 0.127: v27,45.2 26.6,45.6 v21.4,45.6
MOTOR2  (via drill 0.1)
  Top 0.127: MOT2.P$1 10.4,43.4 10.4,41.6 11.2,40.8 11.2,38.6 12.2,38.6 U4.39 | v25.8,46.2 25.8,44.6 27.8,44.6 U1.9
  Bottom 0.127: v25.8,46.2 25.6,46 7.6,46 6.6,45 6.6,44 8.2,44 MOT2.P$1
MOTOR3  (via drill 0.1)
  Top 0.127: MOT3.P$1 6.8,44.8 4.2,42.2 4.2,39 6.2,39 7.2,38 7.2,37.6 12.2,37.6 U4.41 | v27,44.2 27.8,44.2 U1.10
  Bottom 0.127: v27,44.2 26.8,44.4 19.2,44.4 18,45.6 8.4,45.6 7.6,44.8 MOT3.P$1
MOTOR_ENABLE  (via drill 0.1)
  Top 0.127: U4.33 14.6,40.8 v14.4,41 | v25.2,42.6 26.2,43.6 27.8,43.6 U1.11
  Route2 0.127: v14.4,41 16.4,39 16.6,39.2 21.8,39.2 v25.2,42.6
MOTOR_FAULT  (via drill 0.1, 0.3)
  Top 0.127: v17,41.2 17,40.2 U4.28 | v25.6,48 25.6,51 28.6,51 28.8,51.2 28.8,51.6 30.2,51.6 30.4,51.4 30.4,49.6 30.6,49.4 U1.44 | R14.P$2 21.3,44.95 v22.55,44.95
  Route2 0.127: v25.6,48 v22.55,44.95 19,41.4 17.2,41.4 v17,41.2
MOTOR_HIZ  (via drill 0.1)
  Top 0.127: 13,37.6 13,37 12.4,37 U4.42 | 13,37.6 12.6,38 12.4,38 U4.40 | 13,37.6 13,39 12.4,39 U4.38 12.2,39 v11.6,39 | v30,51.2 30,49.4 U1.45
  Bottom 0.127: v30,51.2 13.6,51.2 9.2,46.8 8,46.8 4.2,43 4.2,38.4 11,38.4 v11.6,39
N$5
  Top 0.3: R10.P$1 11.72,33.97 U4.48
N$8
  Top 0.254: R12.P$1 R11.P$2 11.01,31.74 12.52,33.25 U4.1
N$10
  Top 0.254: U4.3 14.05,32.91 14.05,32.84 13.51,32.15 C16.P$2
N$11
  Top 0.3: U4.45 11.33,35.47 C20.P$2
  Top 0.5: C20.P$2 9.1,35.7 D1.CATHODE
  Top 1: D1.CATHODE 6.22,36 L1.2
N$12
  Top 0.3: U4.44 11.93,35.97 C20.P$1
N$13
  Top 0.254: C16.P$1 13.08,31.48 13.51,31.47 13.82,31.78 13.87,31.78 14.27,32.46 14.59,32.84 U4.4
N$14
  Top 0.254: U4.5 15.1,32.35 C15.P$2
N$16
  Top 0.216: U4.36 C17.P$2
N$17
  Bottom 0.254: R1.P$2 21.1,6.05 D3.ANODE
N$18
  Bottom 0.254: D2.ANODE 24.2,5.15 R2.P$2
NRST  (via drill 0.1)
  Top 0.127: U1.7 27.8,45.6 C3.P$1 26.2,45.6 v26.2,47 | v17.4,47 16.8,47.6 SWD.2
  Bottom 0.127: v17.4,47 v26.2,47
SHA
  Top 0.254: U4.9 17.1,30.6 16.7,30.1 13.8,30.1 12.6,28.99 12.6,26.5 11.3,25.2 11.3,22.7 13.65,20.35 Q2.PAD
  pour Top (no thermals): 5.7,18.7 9.1,18.7 9.1,17.3 9.3,17.1 10.5,17.1 11,17.6 11,18.7 16.3,18.7 16.3,14.8 11.4,14.8 9.9,13.3 7.1,13.3 5.7,14.7 5.7,14.8
SHB
  Top 0.254: Q4.8 22.9,18.93 22.9,33.8 21.23,35.47 U4.16
  pour Top (no thermals): 17.6,18.7 27.1,18.7 27.1,14.8 25.9,14.8 24.65,13.55 20.9,13.55 19.85,14.8 17.6,14.8
SHC
  Top 0.254: Q6.5 35.85,17.95 35.3,18.5 35.3,29.5 31.7,33.1 26.1,33.1 22.23,36.97 U4.19
  pour Top (no thermals): 29.7,18.7 33.1,18.7 33.1,17.1 34.5,17.1 34.9,17.5 34.9,17.9 35.7,18.7 40.3,18.7 40.3,14.8 39,13.5 35.8,13.5 34.5,14.8 30.8,14.8 30.8,16.9 30.3,17.3 29.7,17.3
SNA
  Top 0.254: U4.12 18.6,29.9 17.48,28.78 SH1.1
SNB
  Top 0.254: U4.13 19.2,33.84 19.2,29.3 18.1,28.2 SH2.1
SNC
  Top 0.254: SH3.1 37.13,29.97 32.5,34.6 26.68,34.6 22.81,38.47 U4.22
SPA
  Top 0.254: U4.11 18.1,30.2 17.3,29.3 14.3,29.3 14.3,26.2 RA.2
  pour Top (no thermals): 13,23.7 13,24.9 13.8,25.7 16.5,25.7 16.5,22.9 13,22.9
SPB  (via drill 0.6)
  Top 0.254: U4.14 20.19,34.47 20.3,34.36 v20.3,30.7 | v21.5,28.5 RB.2
  Bottom 0.254: v20.3,30.7 20.3,28.8 20.6,28.5 v21.5,28.5
  pour Top (no thermals): 19,24 19.7,24.7 20.1,24.7 20.7,25.3 20.7,27.7 22.3,27.7 22.3,23 19,23
SPC
  Top 0.254: RC.2 36.6,26.3 36.6,29.7 32.2,34.1 26.5,34.1 22.63,37.97 U4.21
  pour Top (no thermals): 36.9,22.9 36.9,26.2 38.9,26.2 40.3,24.8 40.3,22.9
SWCLK  (via drill 0.1)
  Top 0.127: v34,50.2 34,49.4 U1.37 | v22.8,49.8 12.2,49.8 12.2,47.8 SWD.5
  Bottom 0.127: v34,50.2 33.6,49.8 v22.8,49.8
SWDIO  (via drill 0.1)
  Top 0.127: v34.6,49.2 34.6,48.6 U1.36 | v23.2,49.4 15.2,49.4 15.2,47.8 SWD.3
  Bottom 0.127: v34.6,49.2 34.4,49.4 v23.2,49.4
V+  (via drill 0.3, 0.5)
  Top 0.216: R5.P$2 v11.3,41.6
  Top 0.254: U4.7 U4.6 15.87,32.98 C14.P$1 14.86,31.14 C15.P$1 14.81,31.1 v14.2,31.1 | v10.5,32.5 10,33 C19.P$1 9.75,33.1 R10.P$2
  Top 0.3: R10.P$2 12.38,34.45 U4.47
  other vias: 24.4,24.9 25.5,24.9 26.6,24.9 27.6,24.9 30.4,24.9 31.4,24.9 32.7,24.9 33.8,24.9 6.3,24.9 7.4,24.9 8.6,24.9 9.7,24.9 5,26.6 5,25.6 5,24.5 5,23.6 5,22.3 5,21.4 5,20.1 5,19.2 5,17.9 5,17 41,26.7 41,25.8 41,24.6 41,23.7 41,22.3 41,21.4 41,20.1 41,19.2 41,17.9 41,17
  pour Route15 (no thermals): 0.5,0.5 0.5,38.9 7,38.9 7,41.8 18.7,41.8 18.7,29.8 35.8,29.8 40.7,27.5 45.5,27.5 45.5,0.5
  pour Top (no thermals): 23.7,23.1 23.7,26.5 28.2,26.5 28.3,26.5 28.3,23.1
  pour Top (no thermals): 29.7,23.1 29.7,26.5 33.9,26.5 34.3,26.5 34.3,23.1
  pour Top (no thermals): 5.7,23.1 5.7,26.6 9.9,26.6 10.3,26.6 10.3,23.1
  pour Top (no thermals): 3.6,27.1 5.4,27.1 5.4,16.4 3.6,16.4
  pour Top (no thermals): 4.8,26.6 7.1,26.6 7.1,19.5 4.8,19.5
  pour Top (no thermals): 40.6,27.1 42.4,27.1 42.4,16.4 40.6,16.4
  pour Bottom (no thermals): 3.5,25.5 42,25.5 42,17.5 3.5,17.5
V-  (via drill 0.25, 0.3, 0.5)
  Top 0.127: RA.1 16.46,28.2 SH1.2 | SH2.2 18.7,27.71 RB.1 | RC.1 37.13,28.3 SH3.2
  Top 0.254: U4.2 13.6,34.47 U4.P5 | R12.P$2 v8,30.4 | v8,33 C19.P$2 | C14.P$2 15.87,31.37 v16,31.48
  Top 0.3: U4.43 13.6,36.47 U4.P15
  other vias: 15.1,26.9 16.2,26.9 17.3,27.9 17.3,26.9 17.3,25.9 18.2,25.3 37.4,27 38.4,27 39.4,28.7 39.4,27.7 2.2,26.6 2.2,25.7 2.2,24.5 2.2,23.6 2.2,22.3 2.2,21.4 2.2,20.1 2.2,19.2 2.2,17.9 2.2,17 43.9,26.7 43.9,25.8 43.9,24.5 43.9,23.6 43.9,22.3 43.9,21.4 43.9,20.1 43.9,19.2 43.9,17.9 43.9,17 6.3,27.9 7.4,27.9 8.6,27.9 9.7,27.9 24.4,27.8 25.4,27.8 26.6,27.8 27.6,27.8 30.4,27.8 31.4,27.8 32.7,27.8 33.7,27.8 10.3,40.8 10.3,39.9 10.3,39
  pour Route2 (no thermals): 0.5,0.5 0.5,38.9 7,38.9 7,41.8 18.6,41.8 18.6,29.8 35.9,29.8 40.7,27.5 45.5,27.5 45.5,0.5
  pour Top (no thermals): 14.7,28.5 17.8,28.5 17.8,27.5 19.4,27.5 19.4,25.5 19,25.5 18.3,24.8 17.6,24.8 16.9,25.5 16.9,26.4 14.7,26.4
  pour Top (no thermals): 37,28.7 37,26.6 39.8,26.6 39.8,29.2 37.7,29.2 37.5,29.2
  pour Top (no thermals): 0.7,27.1 2.8,27.1 2.8,16.4 0.7,16.4
  pour Top (no thermals): 43.4,27.1 45.4,27.1 45.4,16.3 43.4,16.3
  pour Top (no thermals): 5.8,29.5 10.3,29.5 10.3,27.4 5.8,27.4
  pour Top (no thermals): 24,29.3 28.2,29.3 28.2,27.3 24,27.3
  pour Top (no thermals): 29.9,29.1 34.1,29.1 34.1,27.3 29.9,27.3
  pour Top (no thermals): 8,41.2 10.8,41.2 10.8,38.5 8,38.5
  pour Bottom (no thermals): 1.8,25.9 1.8,29.6 44.3,29.6 44.3,25.9
VBAT_SENSE  (via drill 0.1)
  Top 0.127: v36.4,44.2 36.4,45.6 34.8,45.6 U1.30 | v10,41.8 9.8,42 9.8,42.4 R5.P$1
  Top 0.216: R6.P$2 R5.P$1
  Bottom 0.127: v36.4,44.2 36.4,34.8 22.4,34.8 17.2,40 12,40 10.2,41.8 v10,41.8
VTEMP_FET  (via drill 0.1)
  Top 0.127: v36.8,45 36.8,46.2 34.8,46.2 U1.31 | v31.2,32 29.8,32 29.8,30.9
  Top 0.254: C13.P$1 R9.P$1 R8.P$2 29.35,16.45 29.3,16.5 29.3,30.4 29.8,30.9
  Bottom 0.127: v36.8,45 36.8,32 v31.2,32
VTEMP_MOT
  Top 0.127: TEMP2.P$1 R7.P$1 38.6,52.2 38.6,38.6 40.8,36.4 40.8,30.6 37.8,30.6 36.4,32 36.4,40.4 35,41.8 35,43 34.8,43.2 U1.25

### Text on the board
tPlace: SER | 2 | 1 | DBG | R | T | G | TEMP | 3V | MOT | 3 | 2 | 1 | G | SPI | C | K | MO | MI | DAC | moteus r4.3 | (c) 2020 | B | A | C